# EAGLE board ABK-ECS - Rev B1 (EAGLE 7.7.0)
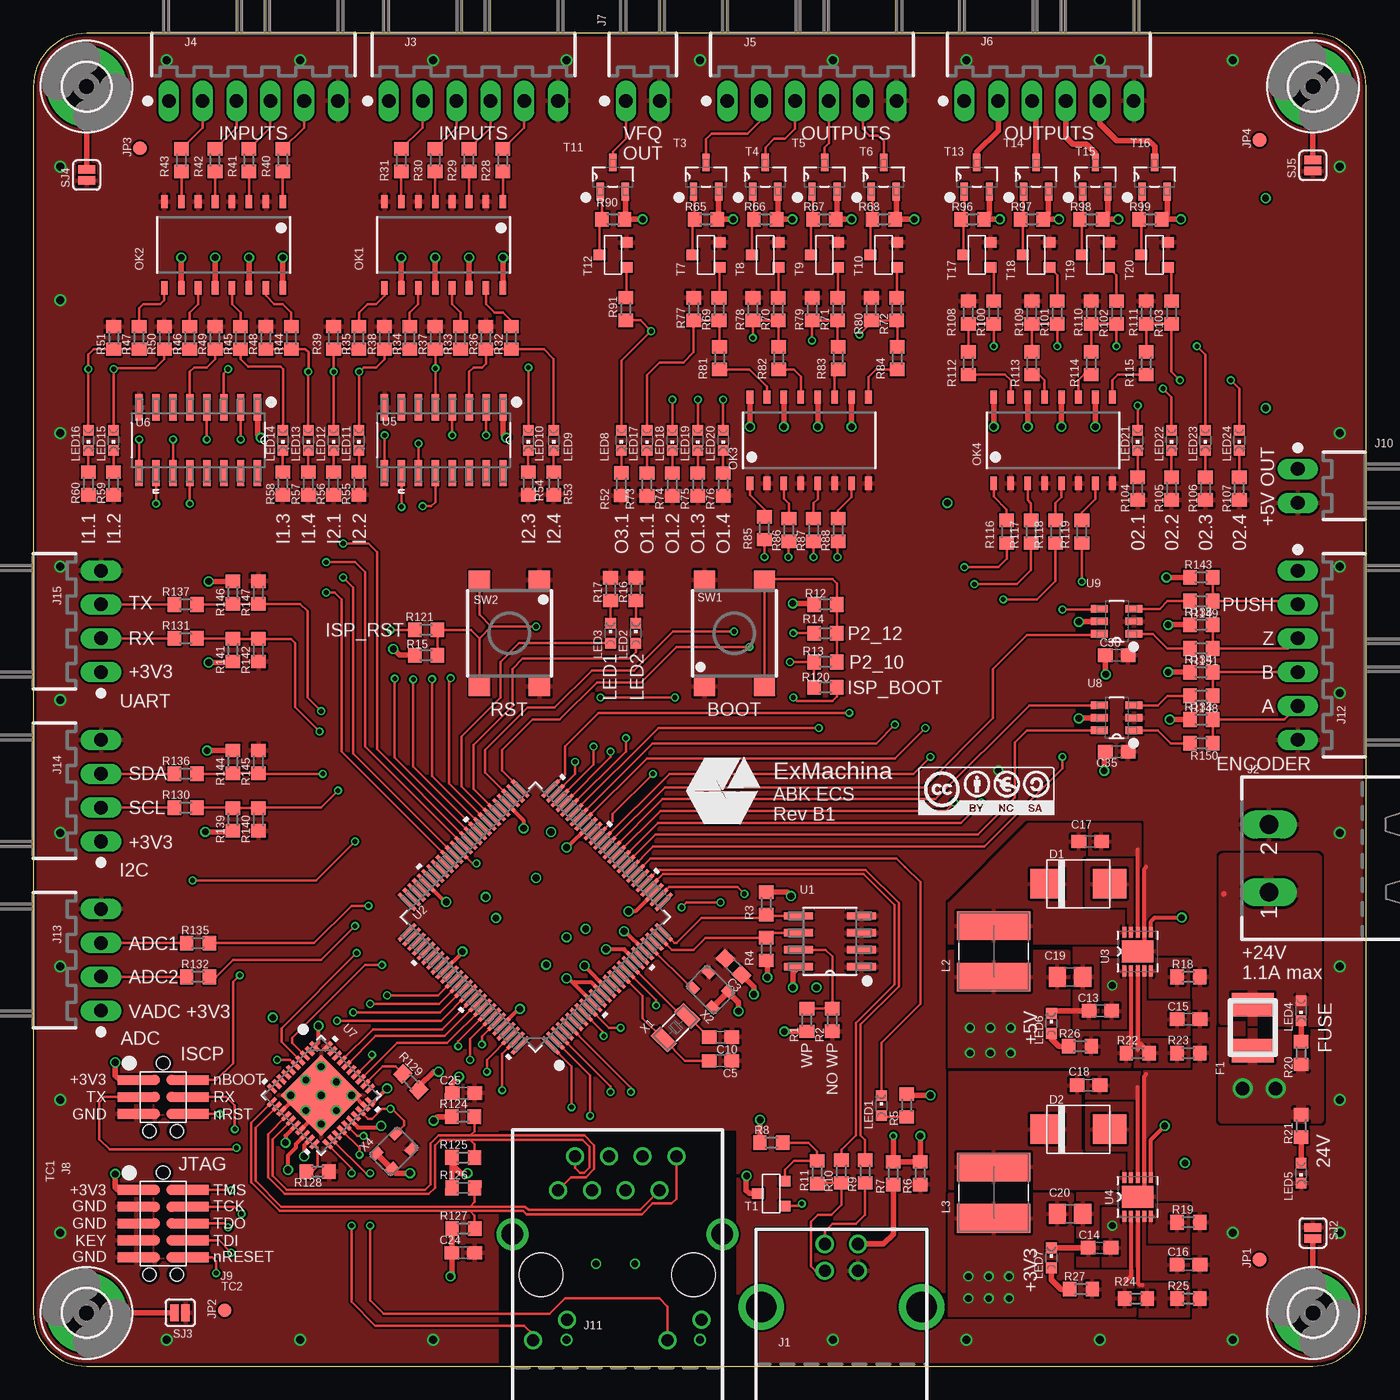
[diagram p8: board, top side]
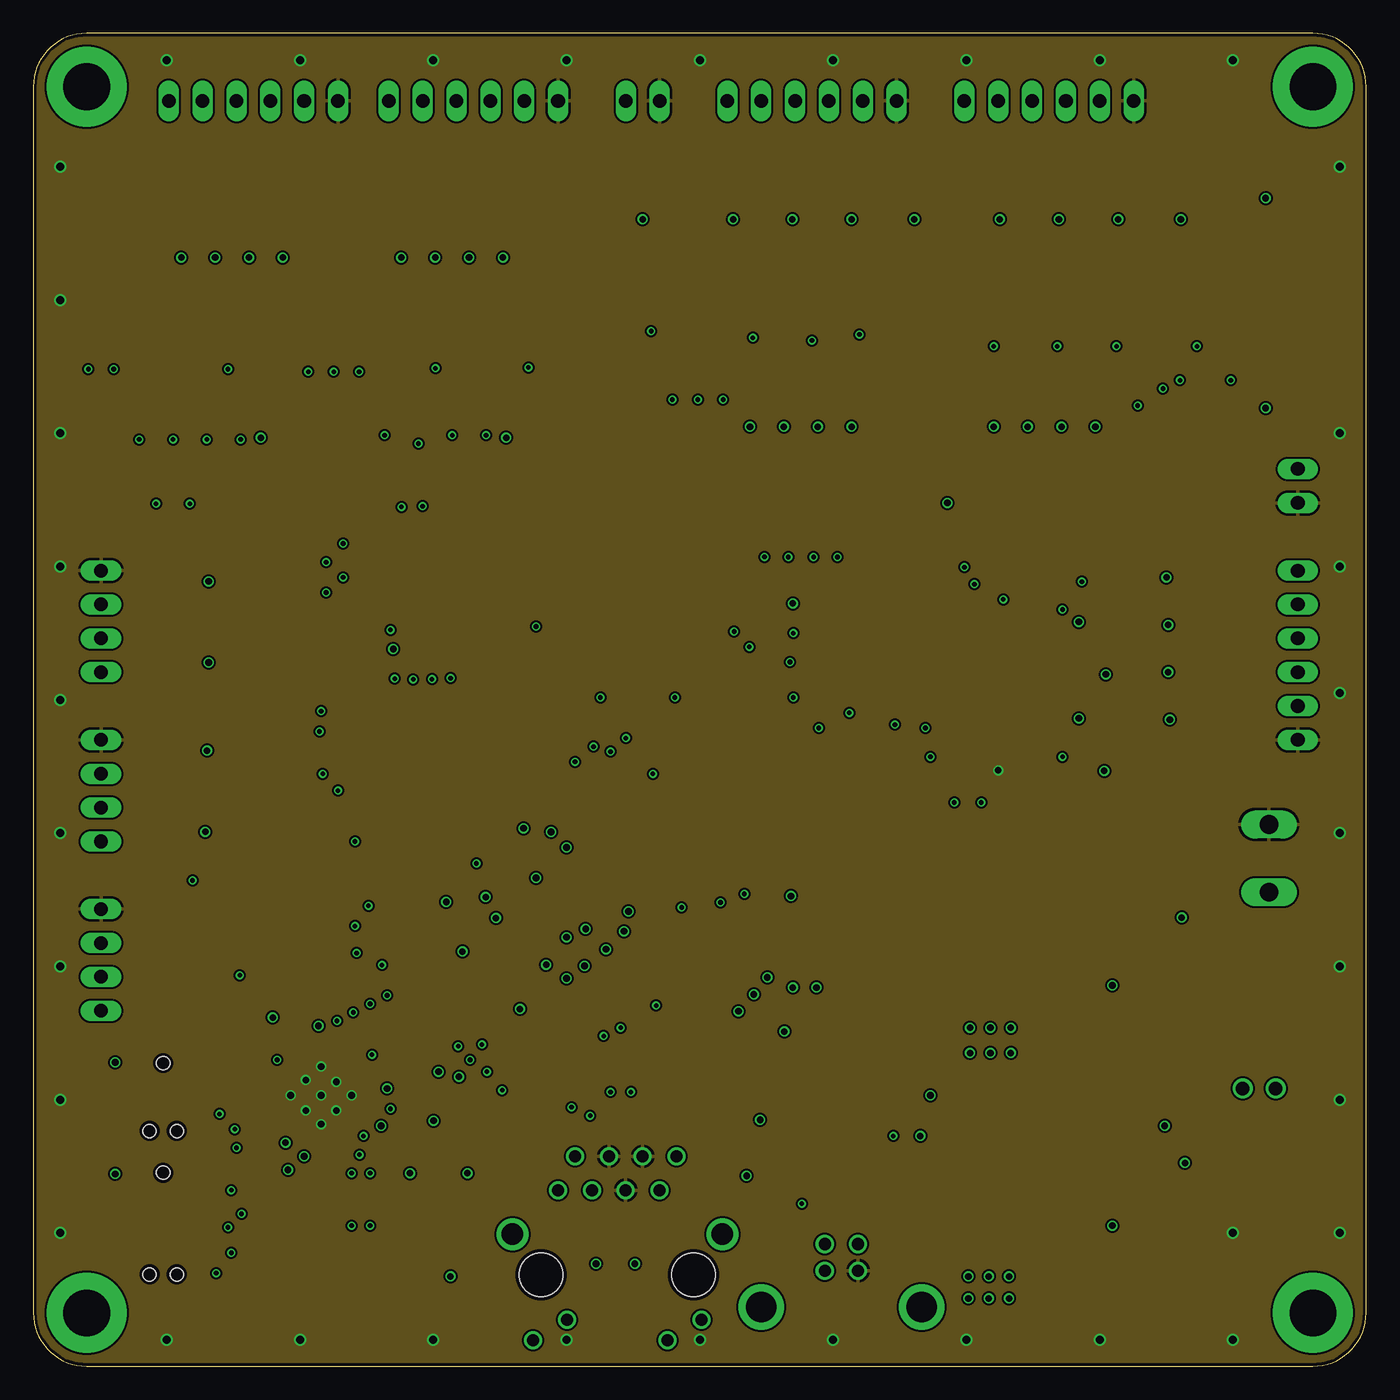
[diagram p9: board, inner layer Route2]
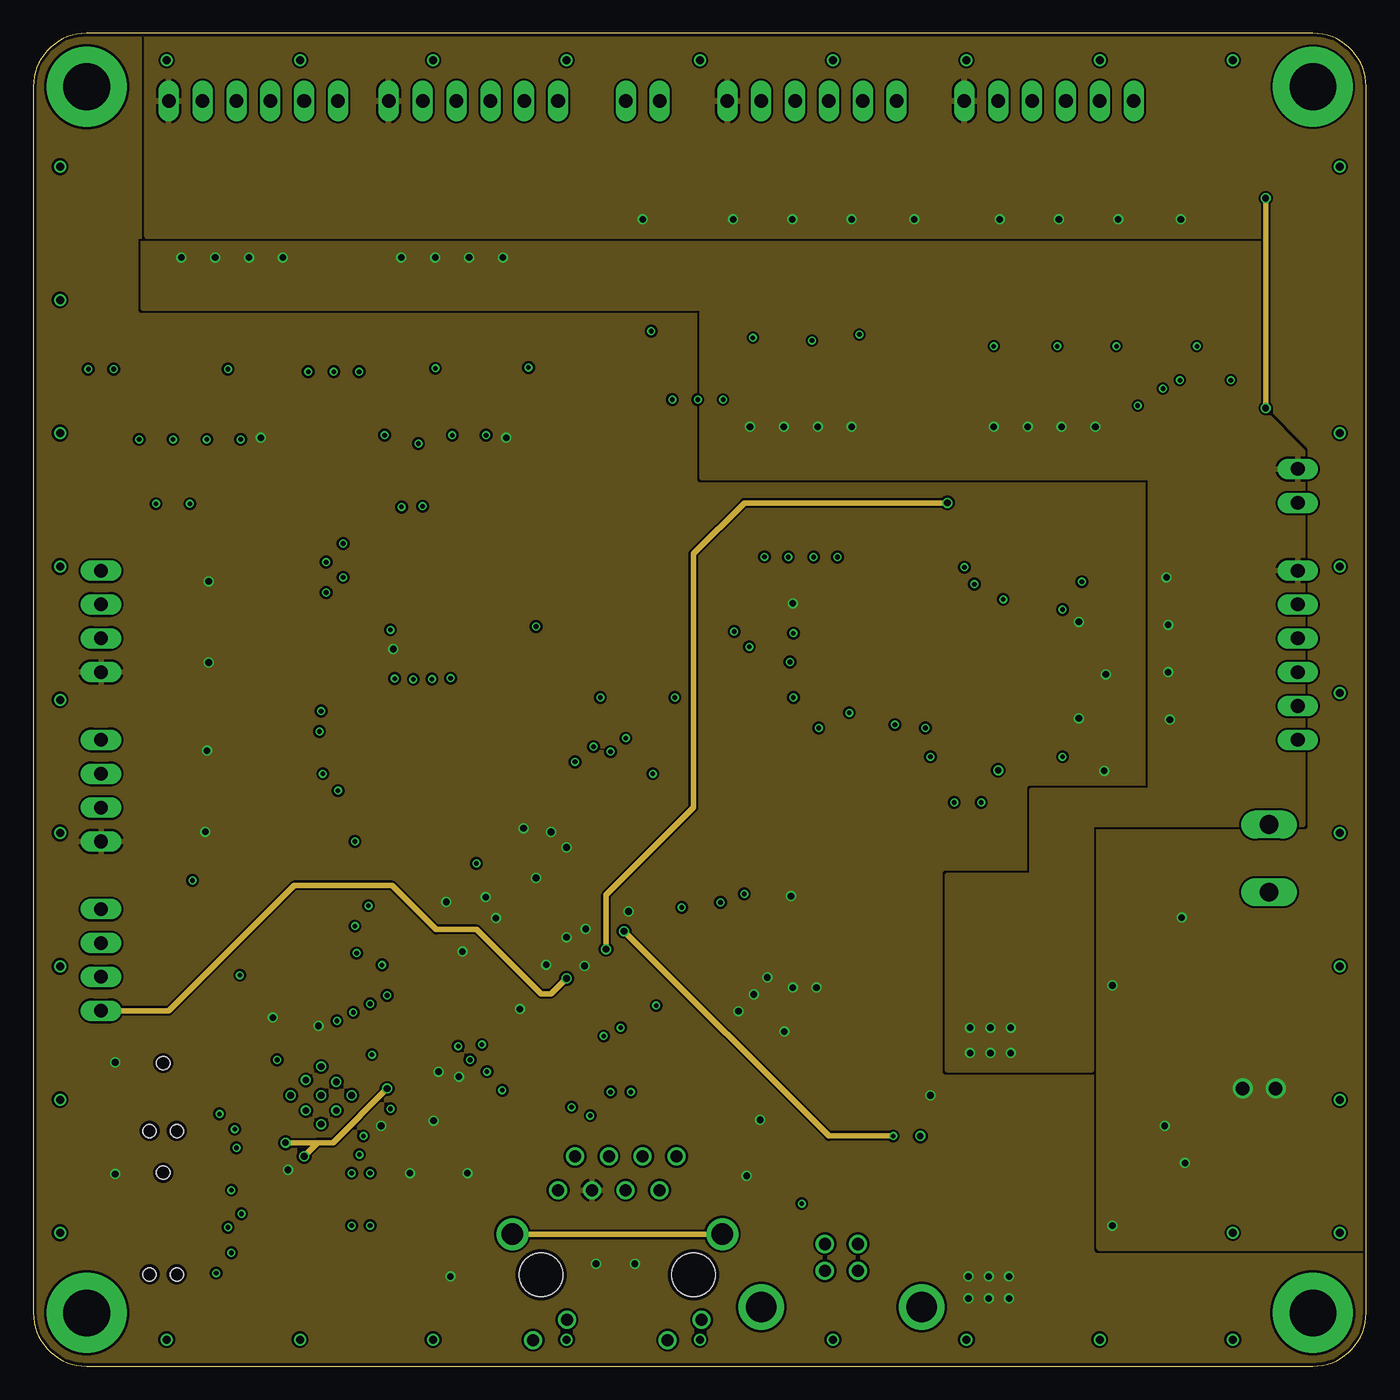
[diagram p10: board, inner layer Route15]
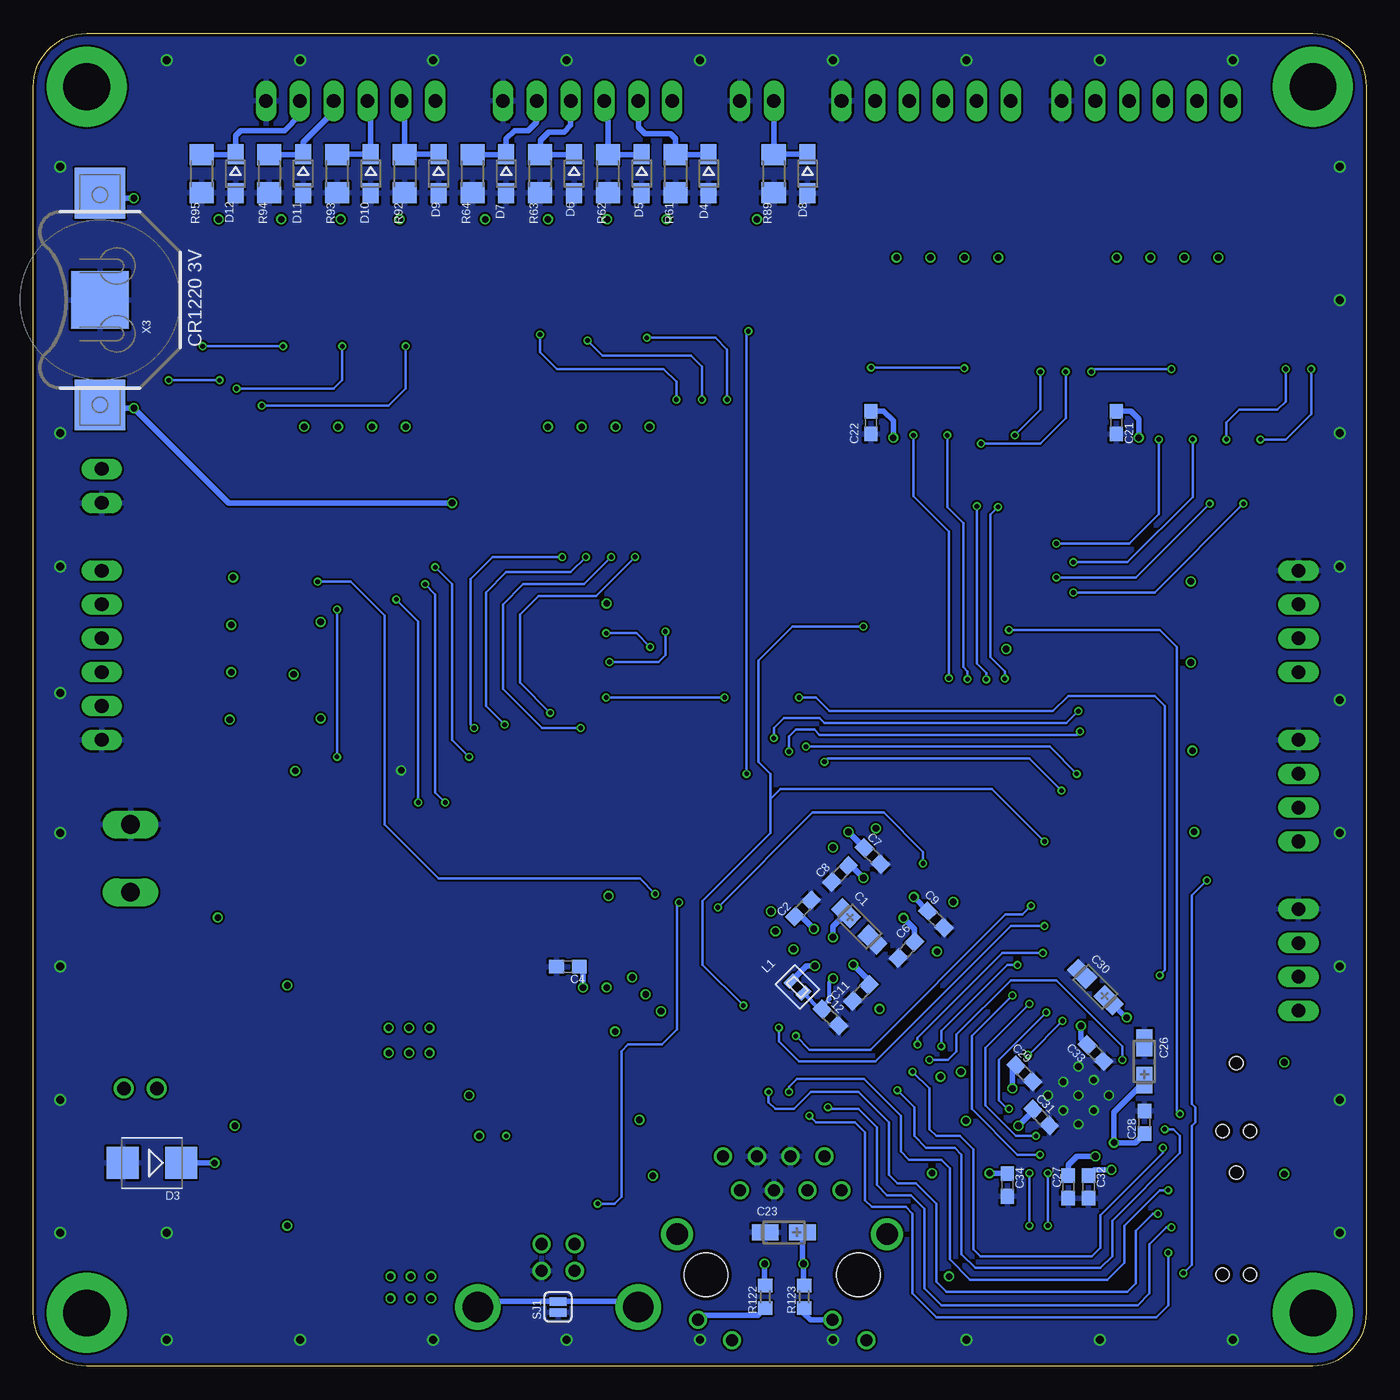
[diagram p11: board, bottom side, seen from below]

Size 100 x 100 mm. Coordinates in mm from the lower left corner, seen from the top.
Outline: 4,0 96,0 arc90 100,4 100,96 arc90 96,100 4,100 arc90 0,96 0,4 arc90 4,0
Copper layers (1+2*15+16): Top 0.018mm / dielectric 0.36mm / Route2 0.035mm / dielectric 0.71mm / Route15 0.035mm / dielectric 0.2mm / Bottom 0.018mm
Design rules "eC_4Layer_PClass6_BaseCopperO18-I35_eCDefault *": minimum track width 0.15mm, minimum drill 0.35mm, track to track 0.15mm, track to pad 0.15mm, pad to pad 0.15mm, via to via 0.15mm, smd to smd 0mil, copper to edge 0.25mm, drill to drill 0.35mm, minimum pad ring 0.175mm, minimum via ring 0.125mm, stop-mask expansion 0mil, vias tented up to drill 0.45mm, thermal gap 0.2mm
Net classes: 1 signal: width 0.178 mm, drill 0.35 mm; 2 supply: width 0.008 mm, drill 0.5 mm

## Footprints (pad centres in the part's own frame; a part is rotated, then mirrored left to right if it is on the bottom)
CT3216 = smd 2 x 1.2: + -1.4,0; - 1.4,0
C0603 = smd 1.1 x 1: 1 -0.85,0; 2 0.85,0
C0805 = smd 1.3 x 1.5: 1 -0.95,0; 2 0.95,0
DO-214AA = smd 2.5 x 2.2: A 2.35,0; C -2.35,0
SMB = smd 2.4 x 2.4: A 2.2,0; C -2.2,0
SOD323-W = smd 1.5 x 1.2: A 1.45,0; C -1.45,0
LITTLEFUSE_SMD = smd 1.78 x 3.15: 1 -1.725,0; 2 1.725,0
USB-B-S-RA = drill 0.914: 1 1.245,4.724; 2 -1.245,4.724; 3 -1.245,2.718; 4 1.245,2.718 | drill 2.286: SHL 6.02,0; SHL1 -6.02,0
MSTBA2 = drill 1.397 long: 1 -2.54,5.08; 2 2.54,5.08
7395-06 = drill 1.016 long: 1 6.35,0; 2 3.81,0; 3 1.27,0; 4 -1.27,0; 5 -3.81,0; 6 -6.35,0
7395-02 = drill 1.016 long: 1 1.27,0; 2 -1.27,0
FTSH-103-01-L-DV-NOPASTE = smd 0.737 x 2.794: 1 -1.27,-2.032; 2 -1.27,2.032; 3 0,-2.032; 4 0,2.032; 5 1.27,-2.032; 6 1.27,2.032
FTSH-105-01-L-DV-NOPASTE = smd 0.737 x 2.794: 1 -2.54,-2.032; 2 -2.54,2.032; 3 -1.27,-2.032; 4 -1.27,2.032; 5 0,-2.032; 6 0,2.032; 7 1.27,-2.032; 8 1.27,2.032; 9 2.54,-2.032; 10 2.54,2.032
WIZNET_RB1-125BAG1A = drill 0.9: L1 6.325,-3.38; L2 3.784,-4.899; L3 -3.786,-3.379; L4 -6.325,-4.9 | drill 0.9 pad 1.3: R1 -4.446,6.349; R2 -3.176,8.889; R3 -1.906,6.349; R4 -0.636,8.889; R5 0.634,6.349; R6 1.904,8.889; R7 3.174,6.349; R8 4.444,8.889 | drill 1.6 pad 2.184: S1 -7.876,3.049; S2 7.874,3.049 | hole 3.3: 5.714,-0.001; -5.716,-0.001
7395-04 = drill 1.016 long: 1 3.81,0; 2 1.27,0; 3 -1.27,0; 4 -3.81,0
FIDUCIAL-1X2 = smd 1 x 1: 1 0,0
0603 = smd 0.64 x 1.02: P$1 -0.64,0; P$2 0.64,0
WE-PD2_5848/5820 = smd 2.15 x 5.5: 1 -1.925,0; 2 1.925,0
CHIPLED_0603 = smd 0.8 x 0.8: A 0,-0.75; C 0,0.75
P3,5 = drill 3.5 pad 6: 1 0,0
MINI-FLAT-16 = smd 1 x 0.5: 1 -3.24,4.445; 2 -3.24,3.175; 3 -3.24,1.905; 4 -3.24,0.635; 5 -3.24,-0.635; 6 -3.24,-1.905; 7 -3.24,-3.175; 8 -3.24,-4.445; 9 3.24,-4.445; 10 3.24,-3.175; 11 3.24,-1.905; 12 3.24,-0.635; 13 3.24,0.635; 14 3.24,1.905; 15 3.24,3.175; 16 3.24,4.445
R0603 = smd 1 x 1.1: 1 -0.85,0; 2 0.85,0
R1206 = smd 1.6 x 1.803: 1 -1.422,0; 2 1.422,0
SJ_2S = smd 0.635 x 1.27: 1 -0.412,0; 2 0.412,0
B3FS = smd 1.4 x 1.6: 1 4,-2.25; 2 -4,-2.25; 3 4,2.25; 4 -4,2.25
SOT−23 = smd 0.787 x 0.889: 1 0.94,1.003; 2 -0.94,1.003; 3 0,-1.003
SOT95P240X112-3N = smd 1.321 x 0.559: 1 -1.092,0.94; 2 -1.092,-0.94; 3 1.092,0
TC2030-IDC-NL = smd 0.787 x 0.787: 1 -1.27,-0.635; 2 -1.27,0.635; 3 0,-0.635; 4 0,0.635; 5 1.27,-0.635; 6 1.27,0.635 | hole 0.991: -2.54,0; 2.54,1.016; 2.54,-1.016
TC2050-IDC-NL = smd 0.787 x 0.787: 1 -2.54,-0.635; 2 -2.54,0.635; 3 -1.27,-0.635; 4 -1.27,0.635; 5 0,-0.635; 6 0,0.635; 7 1.27,-0.635; 8 1.27,0.635; 9 2.54,-0.635; 10 2.54,0.635 | hole 0.991: -3.81,0; 3.81,1.016; 3.81,-1.016
SOIC127P600X175-8N = smd 2.184 x 0.559: 1 -2.362,1.905; 2 -2.362,0.635; 3 -2.362,-0.635; 4 -2.362,-1.905; 5 2.362,-1.905; 6 2.362,-0.635; 7 2.362,0.635; 8 2.362,1.905
SOT407-1 = smd 1.727 x 0.279: 1 -7.62,6; 2 -7.62,5.5; 3 -7.62,5; 4 -7.62,4.5; 5 -7.62,4; 6 -7.62,3.5; 7 -7.62,3; 8 -7.62,2.5; 9 -7.62,2; 10 -7.62,1.5; 11 -7.62,1; 12 -7.62,0.5; 13 -7.62,0; 14 -7.62,-0.5; 15 -7.62,-1; 16 -7.62,-1.5; 17 -7.62,-2; 18 -7.62,-2.5; 19 -7.62,-3; 20 -7.62,-3.5; 21 -7.62,-4; 22 -7.62,-4.5; 23 -7.62,-5; 24 -7.62,-5.5; 25 -7.62,-6; 51 7.62,-6; 52 7.62,-5.5; 53 7.62,-5; 54 7.62,-4.5; 55 7.62,-4; 56 7.62,-3.5; 57 7.62,-3; 58 7.62,-2.5; 59 7.62,-2; 60 7.62,-1.5; 61 7.62,-1; 62 7.62,-0.5; 63 7.62,0; 64 7.62,0.5; 65 7.62,1; 66 7.62,1.5; 67 7.62,2; 68 7.62,2.5; 69 7.62,3; 70 7.62,3.5; 71 7.62,4; 72 7.62,4.5; 73 7.62,5; 74 7.62,5.5; 75 7.62,6 | smd 0.279 x 1.727: 26 -6,-7.62; 27 -5.5,-7.62; 28 -5,-7.62; 29 -4.5,-7.62; 30 -4,-7.62; 31 -3.5,-7.62; 32 -3,-7.62; 33 -2.5,-7.62; 34 -2,-7.62; 35 -1.5,-7.62; 36 -1,-7.62; 37 -0.5,-7.62; 38 0,-7.62; 39 0.5,-7.62; 40 1,-7.62; 41 1.5,-7.62; 42 2,-7.62; 43 2.5,-7.62; 44 3,-7.62; 45 3.5,-7.62; 46 4,-7.62; 47 4.5,-7.62; 48 5,-7.62; 49 5.5,-7.62; 50 6,-7.62; 76 6,7.62; 77 5.5,7.62; 78 5,7.62; 79 4.5,7.62; 80 4,7.62; 81 3.5,7.62; 82 3,7.62; 83 2.5,7.62; 84 2,7.62; 85 1.5,7.62; 86 1,7.62; 87 0.5,7.62; 88 0,7.62; 89 -0.5,7.62; 90 -1,7.62; 91 -1.5,7.62; 92 -2,7.62; 93 -2.5,7.62; 94 -3,7.62; 95 -3.5,7.62; 96 -4,7.62; 97 -4.5,7.62; 98 -5,7.62; 99 -5.5,7.62; 100 -6,7.62
DFN300X300X80-11N = smd 0.813 x 0.305: 1 -1.448,0.991; 2 -1.448,0.508; 3 -1.448,0; 4 -1.448,-0.508; 5 -1.448,-0.991; 6 1.448,-0.991; 7 1.448,-0.508; 8 1.448,0; 9 1.448,0.508; 10 1.448,0.991 | smd 1.651 x 2.388: 11 0,0
SOIC127P600X175-16N = smd 1.981 x 0.559: 1 -2.464,4.445; 2 -2.464,3.175; 3 -2.464,1.905; 4 -2.464,0.635; 5 -2.464,-0.635; 6 -2.464,-1.905; 7 -2.464,-3.175; 8 -2.464,-4.445; 9 2.464,-4.445; 10 2.464,-3.175; 11 2.464,-1.905; 12 2.464,-0.635; 13 2.464,0.635; 14 2.464,1.905; 15 2.464,3.175; 16 2.464,4.445
SQA40B = smd 0.813 x 0.305: 1 -2.946,2.25; 2 -2.946,1.75; 3 -2.946,1.25; 4 -2.946,0.75; 5 -2.946,0.25; 6 -2.946,-0.25; 7 -2.946,-0.75; 8 -2.946,-1.25; 9 -2.946,-1.75; 10 -2.946,-2.25; 21 2.946,-2.25; 22 2.946,-1.75; 23 2.946,-1.25; 24 2.946,-0.75; 25 2.946,-0.25; 26 2.946,0.25; 27 2.946,0.75; 28 2.946,1.25; 29 2.946,1.75; 30 2.946,2.25 | smd 0.305 x 0.813: 11 -2.25,-2.946; 12 -1.75,-2.946; 13 -1.25,-2.946; 14 -0.75,-2.946; 15 -0.25,-2.946; 16 0.25,-2.946; 17 0.75,-2.946; 18 1.25,-2.946; 19 1.75,-2.946; 20 2.25,-2.946; 31 2.25,2.946; 32 1.75,2.946; 33 1.25,2.946; 34 0.75,2.946; 35 0.25,2.946; 36 -0.25,2.946; 37 -0.75,2.946; 38 -1.25,2.946; 39 -1.75,2.946; 40 -2.25,2.946 | smd 4.3 x 4.3: 41 0,0
SOT95P280X145-6N = smd 1.27 x 0.559: 1 -1.295,0.94; 2 -1.295,0; 3 -1.295,-0.94; 4 1.295,-0.94; 5 1.295,0; 6 1.295,0.94
FC-135 = smd 1 x 1.8: 1 -1.25,0; 2 1.25,0
ASE = smd 0.9 x 0.65: 1 -1.05,-0.825; 2 1.05,-0.825; 3 1.05,0.825; 4 -1.05,0.825
3000 = smd 3.81 x 3.81: +1 -7.874,0; +2 8.001,0 | smd 4.318 x 4.318: - 0,0

## Placement (x,y rotation side)
C1  10uF  [CT3216]  38.03,32.99 315 bottom
C2  0.1uF  [C0603]  42.25,34.34 45 bottom
C3  0.1uF  [C0603]  52.53,29.97 135 top
C4  0.1uF  [C0603]  59.89,29.97 180 bottom
C5  18pF  [C0603]  51.56,22.91 0 top
C6  0.1uF  [C0603]  34.49,31.24 225 bottom
C7  0.1uF  [C0603]  37.05,38.29 315 bottom
C8  0.1uF  [C0603]  39.47,36.94 225 bottom
C9  0.1uF  [C0603]  32.29,33.53 315 bottom
C10  18pF  [C0603]  51.56,24.69 0 top
C11  0.1uF  [C0603]  37.9,28.01 225 bottom
C12  0.1uF  [C0603]  40.2,26.18 315 bottom
C13  2.2uF  [C0603]  80.06,26.67 180 top
C14  2.2uF  [C0603]  80,8.89 180 top
C15  1000pF  [C0603]  86.67,26.04 0 top
C16  1000pF  [C0603]  86.67,7.62 0 top
C17  2.2uF  [C0603]  79.3,39.37 180 top
C18  2.2uF  [C0603]  79.17,21.08 180 top
C19  22uF  [C0805]  77.78,29.21 0 top
C20  22uF  [C0805]  77.78,11.43 0 top
C21  0.1uF  [C0603]  18.75,70.8 270 bottom
C22  0.1uF  [C0603]  37.16,70.8 270 bottom
C23  4.7uF  [CT3216]  43.69,10.03 180 bottom
C24  100nF  [C0603]  32.26,8.51 359.8 top
C25  100nF  [C0603]  32.27,20.49 359.8 top
C26  10uF  [CT3216]  16.64,22.86 90 bottom
C27  100nF  [C0603]  22.35,13.46 270 bottom
C28  100nF  [C0603]  16.64,18.29 90 bottom
C29  100nF  [C0603]  25.65,21.97 315 bottom
C30  10uF  [CT3216]  20.32,28.45 135 bottom
C31  100nF  [C0603]  24.38,18.67 315 bottom
C32  100nF  [C0603]  20.83,13.46 270 bottom
C33  100nF  [C0603]  20.32,23.5 315 bottom
C34  100nF  [C0603]  26.92,13.59 270 bottom
C35  0.1uF  [C0603]  81.28,46.1 0 top
C36  0.1uF  [C0603]  81.28,53.34 0 top
CC1  CC-BY-NC-SA  [CC-BY-NC-SA]  71.5,43.13 0 top
D1  MBRS140  [DO-214AA]  78.41,36.2 0 top
D2  MBRS140  [DO-214AA]  78.41,17.78 0 top
D3  STPS3L40UF  [SMB]  91.11,15.24 180 bottom
D4  1N4148WS  [SOD323-W]  49.33,89.47 270 bottom
D5  1N4148WS  [SOD323-W]  54.36,89.47 270 bottom
D6  1N4148WS  [SOD323-W]  59.44,89.47 270 bottom
D7  1N4148WS  [SOD323-W]  64.52,89.47 270 bottom
D8  1N4148WS  [SOD323-W]  41.91,89.47 270 bottom
D9  1N4148WS  [SOD323-W]  69.6,89.47 270 bottom
D10  1N4148WS  [SOD323-W]  74.68,89.47 270 bottom
D11  1N4148WS  [SOD323-W]  79.76,89.47 270 bottom
D12  1N4148WS  [SOD323-W]  84.84,89.47 270 bottom
F1  1812L110/24DR  [LITTLEFUSE_SMD]  91.49,25.4 270 top
J1  USB-B-S-RA  [USB-B-S-RA]  60.63,4.45 0 top
J2  MSTBA2  [MSTBA2]  97.79,38.1 90 top
J3  22-05-7068-06  [7395-06]  33.02,94.93 180 top
J4  22-05-7068-06  [7395-06]  16.51,94.93 180 top
J5  22-05-7068-06  [7395-06]  58.42,94.93 180 top
J6  22-05-7068-06  [7395-06]  76.2,94.93 180 top
J7  22-05-7028-02  [7395-02]  45.72,94.93 180 top
J8  FTSH-103-01-L-DV-NOPASTE  [FTSH-103-01-L-DV-NOPASTE]  9.74,20.19 270 top
J9  FTSH-105-01-L-DV-NOPASTE  [FTSH-105-01-L-DV-NOPASTE]  9.74,10.7 270 top
J10  22-05-7028-02  [7395-02]  94.87,66.04 90 top
J11  RB1-125BAG1A  [WIZNET_RB1-125BAG1A]  43.81,6.86 0 top
J12  22-05-7068-06  [7395-06]  94.87,53.34 90 top
J13  22-05-7048-04  [7395-04]  5.08,30.48 270 top
J14  22-05-7048-04  [7395-04]  5.08,43.18 270 top
J15  22-05-7048-04  [7395-04]  5.08,55.88 270 top
JP1  FIDUCIAL1X2  [FIDUCIAL-1X2]  92,8 90 top
JP2  FIDUCIAL1X2  [FIDUCIAL-1X2]  14.35,4.19 90 top
JP3  FIDUCIAL1X2  [FIDUCIAL-1X2]  8,91.36 90 top
JP4  FIDUCIAL1X2  [FIDUCIAL-1X2]  92,92 90 top
L1  0603PS-103KLB  [0603]  42.67,28.45 315 bottom
L2  15uH  [WE-PD2_5848/5820]  72.06,31.11 270 top
L3  10uH  [WE-PD2_5848/5820]  72.06,13.02 270 top
LED1  Blue  [CHIPLED_0603]  63.63,19.56 0 top
LED2  Blue  [CHIPLED_0603]  45.21,54.99 0 top
LED3  Blue  [CHIPLED_0603]  43.31,54.99 0 top
LED4  Red  [CHIPLED_0603]  95.12,26.67 180 top
LED5  Blue  [CHIPLED_0603]  95.12,14.48 180 top
LED6  Blue  [CHIPLED_0603]  76.38,25.72 0 top
LED7  Blue  [CHIPLED_0603]  76.38,8.13 0 top
LED8  Blue  [CHIPLED_0603]  44.12,69.47 180 top
LED9  Blue  [CHIPLED_0603]  39.04,69.47 180 top
LED10  Blue  [CHIPLED_0603]  37.13,69.47 180 top
LED11  Blue  [CHIPLED_0603]  24.43,69.47 180 top
LED12  Blue  [CHIPLED_0603]  22.53,69.47 180 top
LED13  Blue  [CHIPLED_0603]  20.62,69.47 180 top
LED14  Blue  [CHIPLED_0603]  18.72,69.47 180 top
LED15  Blue  [CHIPLED_0603]  6.02,69.47 180 top
LED16  Blue  [CHIPLED_0603]  4.13,69.47 180 top
LED17  Blue  [CHIPLED_0603]  46.04,69.46 180 top
LED18  Blue  [CHIPLED_0603]  47.95,69.46 180 top
LED19  Blue  [CHIPLED_0603]  49.85,69.46 180 top
LED20  Blue  [CHIPLED_0603]  51.76,69.46 180 top
LED21  Blue  [CHIPLED_0603]  82.86,69.47 180 top
LED22  Blue  [CHIPLED_0603]  85.39,69.47 180 top
LED23  Blue  [CHIPLED_0603]  87.94,69.47 180 top
LED24  Blue  [CHIPLED_0603]  90.47,69.47 180 top
MP1  MOUNT-PAD3.5  [P3,5]  96,4 90 top
MP2  MOUNT-PAD3.5  [P3,5]  4,4 90 top
MP3  MOUNT-PAD3.5  [P3,5]  4,96 90 top
MP4  MOUNT-PAD3.5  [P3,5]  96,96 90 top
OK1  TLP283-4  [MINI-FLAT-16]  30.79,84.14 270 top
OK2  TLP283-4  [MINI-FLAT-16]  14.28,84.14 270 top
OK3  TLP283-4  [MINI-FLAT-16]  58.22,69.47 90 top
OK4  TLP283-4  [MINI-FLAT-16]  76.5,69.47 90 top
R1  4K7, DNI  [R0603]  58.04,25.97 90 top
R2  4K7  [R0603]  59.94,25.98 270 top
R3  4K7  [R0603]  54.99,34.72 90 top
R4  4K7  [R0603]  54.99,31.29 270 top
R5  1K5  [R0603]  65.53,19.56 270 top
R6  39K  [R0603]  66.55,14.48 90 top
R7  24K  [R0603]  64.52,14.48 270 top
R8  0R, DNI  [R0603]  55.37,16.76 0 top
R9  33  [R0603]  62.41,14.61 90 top
R10  33  [R0603]  60.63,14.61 90 top
R11  1K5  [R0603]  58.8,14.55 270 top
R12  10K  [R0603]  59.44,57.15 180 top
R13  0R  [R0603]  59.44,52.83 0 top
R14  0R  [R0603]  59.44,54.99 0 top
R15  10K  [R0603]  29.46,53.34 180 top
R16  1K5  [R0603]  45.21,58.29 90 top
R17  1K5  [R0603]  43.31,58.29 90 top
R18  31K6  [R0603]  86.67,29.21 180 top
R19  31K6  [R0603]  86.67,10.79 180 top
R20  4K7  [R0603]  95.12,23.5 270 top
R21  4K7  [R0603]  95.12,18.03 90 top
R22  52K3  [R0603]  82.86,23.5 180 top
R23  10K  [R0603]  86.67,23.5 180 top
R24  31K6  [R0603]  82.73,5.08 180 top
R25  10K  [R0603]  86.67,5.08 180 top
R26  1K5  [R0603]  78.54,24 0 top
R27  1K5  [R0603]  78.6,5.78 0 top
R28  1K  [R0603]  35.23,90.48 270 top
R29  1K  [R0603]  32.69,90.48 270 top
R30  1K  [R0603]  30.15,90.48 270 top
R31  1K  [R0603]  27.61,90.48 270 top
R32  1K  [R0603]  35.87,77.15 270 top
R33  1K  [R0603]  32.05,77.15 270 top
R34  1K  [R0603]  28.25,77.15 270 top
R35  1K  [R0603]  24.43,77.15 270 top
R36  4K7  [R0603]  33.96,77.15 90 top
R37  4K7  [R0603]  30.15,77.15 90 top
R38  4K7  [R0603]  26.34,77.15 90 top
R39  4K7  [R0603]  22.53,77.15 90 top
R40  1K  [R0603]  18.72,90.48 270 top
R41  1K  [R0603]  16.18,90.48 270 top
R42  1K  [R0603]  13.64,90.48 270 top
R43  1K  [R0603]  11.11,90.48 270 top
R44  1K  [R0603]  19.36,77.15 270 top
R45  1K  [R0603]  15.54,77.15 270 top
R46  1K  [R0603]  11.73,77.15 270 top
R47  1K  [R0603]  7.94,77.15 270 top
R48  4K7  [R0603]  17.45,77.15 90 top
R49  4K7  [R0603]  13.64,77.15 90 top
R50  4K7  [R0603]  9.83,77.15 90 top
R51  4K7  [R0603]  6.03,77.15 90 top
R52  1K5  [R0603]  44.12,66.17 270 top
R53  1K5  [R0603]  39.04,66.23 270 top
R54  1K5  [R0603]  37.13,66.23 270 top
R55  1K5  [R0603]  24.43,66.23 270 top
R56  1K5  [R0603]  22.53,66.23 270 top
R57  1K5  [R0603]  20.62,66.23 270 top
R58  1K5  [R0603]  18.72,66.23 270 top
R59  1K5  [R0603]  6.02,66.23 270 top
R60  1K5  [R0603]  4.13,66.23 270 top
R61  1K  [R1206]  51.82,89.47 90 bottom
R62  1K  [R1206]  56.9,89.47 90 bottom
R63  1K  [R1206]  61.98,89.47 90 bottom
R64  1K  [R1206]  67.06,89.47 90 bottom
R65  10K  [R0603]  50.47,86.04 0 top
R66  10K  [R0603]  54.91,86.04 0 top
R67  10K  [R0603]  59.36,86.04 0 top
R68  10K  [R0603]  63.8,86.04 0 top
R69  1K  [R0603]  51.45,79.31 90 top
R70  1K  [R0603]  55.89,79.31 90 top
R71  1K  [R0603]  60.34,79.31 90 top
R72  1K  [R0603]  64.78,79.31 90 top
R73  1K5  [R0603]  46.04,66.15 270 top
R74  1K5  [R0603]  47.95,66.15 270 top
R75  1K5  [R0603]  49.85,66.15 270 top
R76  1K5  [R0603]  51.76,66.15 270 top
R77  4K7  [R0603]  49.54,79.31 90 top
R78  4K7  [R0603]  53.99,79.31 90 top
R79  4K7  [R0603]  58.43,79.31 90 top
R80  4K7  [R0603]  62.88,79.31 90 top
R81  100  [R0603]  51.49,75.63 270 top
R82  100  [R0603]  55.93,75.63 270 top
R83  100  [R0603]  60.38,75.63 270 top
R84  100  [R0603]  64.82,75.63 270 top
R85  330  [R0603]  54.85,62.87 270 top
R86  330  [R0603]  56.69,62.74 270 top
R87  330  [R0603]  58.53,62.74 270 top
R88  330  [R0603]  60.38,62.74 270 top
R89  1K  [R1206]  44.45,89.47 90 bottom
R90  10K  [R0603]  43.51,86.04 0 top
R91  100  [R0603]  44.45,79.32 270 top
R92  1K  [R1206]  72.14,89.47 90 bottom
R93  1K  [R1206]  77.22,89.47 90 bottom
R94  1K  [R1206]  82.3,89.47 90 bottom
R95  1K  [R1206]  87.38,89.47 90 bottom
R96  10K  [R0603]  70.47,86.04 0 top
R97  10K  [R0603]  74.92,86.04 0 top
R98  10K  [R0603]  79.36,86.04 0 top
R99  10K  [R0603]  83.81,86.04 0 top
R100  1K  [R0603]  72.06,79.06 90 top
R101  1K  [R0603]  76.82,79.06 90 top
R102  1K  [R0603]  81.27,79.06 90 top
R103  1K  [R0603]  85.39,79.06 90 top
R104  1K5  [R0603]  82.86,65.85 270 top
R105  1K5  [R0603]  85.39,65.85 270 top
R106  1K5  [R0603]  87.94,65.85 270 top
R107  1K5  [R0603]  90.47,65.85 270 top
R108  4K7  [R0603]  70.16,79.06 90 top
R109  4K7  [R0603]  74.92,79.06 90 top
R110  4K7  [R0603]  79.36,79.06 90 top
R111  4K7  [R0603]  83.49,79.06 90 top
R112  100  [R0603]  70.16,75.25 270 top
R113  100  [R0603]  74.92,75.25 270 top
R114  100  [R0603]  79.36,75.25 270 top
R115  100  [R0603]  83.49,75.25 270 top
R116  330  [R0603]  73.01,62.61 270 top
R117  330  [R0603]  74.85,62.61 270 top
R118  330  [R0603]  76.7,62.61 270 top
R119  330  [R0603]  78.66,62.61 270 top
R120  0R  [R0603]  59.44,50.93 0 top
R121  0R  [R0603]  29.46,55.24 180 top
R122  220  [R0603]  45.09,5.21 90 bottom
R123  220  [R0603]  42.16,5.21 90 bottom
R124  49.9  [R0603]  32.24,18.71 359.8 top
R125  49.9  [R0603]  32.25,15.67 359.8 top
R126  49.9  [R0603]  32.26,13.38 359.8 top
R127  49.9  [R0603]  32.27,10.33 359.8 top
R128  4K7  [R0603]  21.34,14.61 0 top
R129  2K2  [R0603]  28.32,21.34 135 top
R130  1K  [R0603]  11.43,41.91 0 top
R131  1K  [R0603]  11.43,54.61 0 top
R132  1K  [R0603]  12.36,29.21 0 top
R133  4K7  [R0603]  87.63,48.51 0 top
R134  4K7  [R0603]  87.63,52.07 0 top
R135  1K  [R0603]  12.36,31.75 0 top
R136  1K  [R0603]  11.43,44.45 0 top
R137  1K  [R0603]  11.43,57.15 0 top
R138  4K7  [R0603]  87.63,55.63 0 top
R139  1K  [R0603]  14.99,41.02 90 top
R140  1K  [R0603]  16.89,41.02 90 top
R141  1K  [R0603]  14.99,53.72 90 top
R142  1K  [R0603]  16.89,53.72 90 top
R143  4K7  [R0603]  87.63,59.18 0 top
R144  1K  [R0603]  14.99,45.34 270 top
R145  1K  [R0603]  16.89,45.34 270 top
R146  1K  [R0603]  14.99,58.04 270 top
R147  1K  [R0603]  16.89,58.04 270 top
R148  1K  [R0603]  87.63,50.29 180 top
R149  1K  [R0603]  87.63,57.4 180 top
R150  1K  [R0603]  87.63,46.74 180 top
R151  1K  [R0603]  87.63,53.85 180 top
SJ1  SJNC  [SJ_2S]  60.63,4.45 90 bottom
SJ2  SJNC  [SJ_2S]  96,10 270 top
SJ3  SJNC  [SJ_2S]  11.02,4 180 top
SJ4  SJNC  [SJ_2S]  4,89.36 90 top
SJ5  SJNC  [SJ_2S]  96,90.08 90 top
SW1  B3FS-1015  [B3FS]  52.6,54.99 270 top
SW2  B3FS-1015  [B3FS]  35.72,54.99 90 top
T1  MMBT2907ALT3  [SOT−23]  55.37,12.95 270 top
T2  EXMACHINA-LOGO-NAME  [EXM-LOGO-BASELINE]  51.69,43.13 0 top
T3  IRLML5103TRPBF  [SOT95P240X112-3N]  50.47,89.22 90 top
T4  IRLML5103TRPBF  [SOT95P240X112-3N]  54.91,89.22 90 top
T5  IRLML5103TRPBF  [SOT95P240X112-3N]  59.36,89.22 90 top
T6  IRLML5103TRPBF  [SOT95P240X112-3N]  63.8,89.22 90 top
T7  MMBT2222AL  [SOT−23]  50.47,83.37 270 top
T8  MMBT2222AL  [SOT−23]  54.91,83.37 270 top
T9  MMBT2222AL  [SOT−23]  59.36,83.37 270 top
T10  MMBT2222AL  [SOT−23]  63.8,83.37 270 top
T11  IRLML5103TRPBF  [SOT95P240X112-3N]  43.48,89.22 90 top
T12  MMBT2222AL  [SOT−23]  43.5,83.36 270 top
T13  IRLML5103TRPBF  [SOT95P240X112-3N]  70.79,89.22 90 top
T14  IRLML5103TRPBF  [SOT95P240X112-3N]  75.23,89.22 90 top
T15  IRLML5103TRPBF  [SOT95P240X112-3N]  79.68,89.22 90 top
T16  IRLML5103TRPBF  [SOT95P240X112-3N]  84.12,89.22 90 top
T17  MMBT2222AL  [SOT−23]  70.79,83.37 270 top
T18  MMBT2222AL  [SOT−23]  75.23,83.37 270 top
T19  MMBT2222AL  [SOT−23]  79.68,83.37 270 top
T20  MMBT2222AL  [SOT−23]  84.12,83.37 270 top
TC1  TC2030-IDC-NL  [TC2030-IDC-NL]  9.74,20.19 270 top
TC2  TC2050-IDC-NL  [TC2050-IDC-NL]  9.74,10.7 270 top
U1  AT24C512C-SSHM-B  [SOIC127P600X175-8N]  59.77,31.88 180 top
U2  LPC1768FBD100  [SOT407-1]  37.67,33.7 135 top
U3  LT3686HDDPBF  [DFN300X300X80-11N]  82.86,31.11 90 top
U4  LT3686HDDPBF  [DFN300X300X80-11N]  82.86,12.7 90 top
U5  CD4050BD  [SOIC127P600X175-16N]  30.8,69.47 270 top
U6  CD4050BD  [SOIC127P600X175-16N]  12.38,69.47 270 top
U7  DP83848JSQ/NOPB  [SQA40B]  21.59,20.32 315 top
U8  SN74LVC2G17DBVR  [SOT95P280X145-6N]  81.28,48.64 180 top
U9  SN74LVC2G17DBVR  [SOT95P280X145-6N]  81.28,55.88 180 top
X1  FC-135  [FC-135]  48.18,25.4 45 top
X2  ASE-12  [ASE]  50.8,28.25 135 top
X3  3000  [3000]  95,80 90 bottom
X4  ASE_50  [ASE]  27.05,16.13 45 top

## Tracks (layer width: path | path; a pad name or v marks a point on that pad's centre or on a via)
1
  Top 0.406: MP1.1 SJ2.2
2
  Top 0.406: SJ3.2 MP2.1
3
  Top 0.406: SJ4.2 MP3.1
4
  Top 0.406: MP4.1 SJ5.2
!ISP_BOOT  (via drill 0.35)
  Top 0.178: TC1.2 J8.2 13.72,21.46 14.99,22.73 14.99,28.83 v15.49,29.34 | v42.55,50.16 v48.13,50.16 | v57.02,50.16 57.28,49.91 59.94,49.91 60.29,50.25 R120.2
  Bottom 0.178: v15.49,29.34 15.11,29.72 15.11,49.53 15.88,50.29 22.35,50.29 23.5,49.15 40.26,49.15 41.27,50.16 v42.55,50.16 | v48.13,50.16 v57.02,50.16
!ISP_RST  (via drill 0.35)
  Top 0.178: TC1.6 J8.6 v13.97,18.92 | v26.8,55.24 R121.2
  Bottom 0.178: v13.97,18.92 14.22,19.18 14.22,53.98 15.49,55.24 v26.8,55.24
!RESET  (via drill 0.35)
  Top 0.178: TC2.10 J9.10 13.43,8.16 13.72,7.87 v13.72,6.99 | U2.17 46.74,27.46 v46.74,27.05 | 33.47,54.61 SW2.4 | R15.1 R121.1 32.84,55.24 33.47,54.61 | 33.47,54.61 34.36,55.5 | 34.36,55.5 v37.72,55.5 | SW2.3 33.47,56.39 34.36,55.5 | v11.94,36.45 21.21,36.45 v24.13,39.37
  Bottom 0.178: v37.72,55.5 43.05,55.5 45.59,52.96 45.59,45.34 44.7,44.45 44.7,42.55 | v46.74,27.05 49.78,30.1 49.78,34.92 44.7,40.01 44.7,42.55 | v11.94,36.45 13.08,35.31 13.08,19.68 12.83,19.43 12.83,18.29 13.08,18.03 13.08,7.62 v13.72,6.99 | v24.13,39.37 28.07,43.31 43.94,43.31 44.7,42.55
+3V3  (via drill 0.5)
  Top 0.305: U4.2 82.35,6.73 82,6.39 | v36.51,26.8 36.42,26.8 U2.96 | U2.13 41.36,30.02 v41.36,30.03 | U2.28 45.16,34.12 v44.66,34.12 | U2.42 40.06,38.92 v40.01,38.92 | U2.54 36.78,40.96 v36.78,40.36 | U2.71 30.88,34.83 v30.98,34.83 | U2.84 32.2,31.05 v32.2,31.11 | U7.18 19.68,16.65 19.68,16.38 19.11,15.81 v19.11,14.73 | U7.1 21.39,24.29 v21.39,25.52 | U7.26 24.36,17.91 25.97,17.91 v26.09,18.03
  Top 0.406: U6.1 16.83,69.9 v17.07,69.66 | U5.1 35.24,69.9 v35.48,69.66 | C3.1 54.05,28.44 v54.05,27.9 | X2.4 X2.1 52.91,27.3 v52.91,26.63 | 55.04,35.52 R3.2 56.54,35.57 v56.85,35.27 | v56.98,28.41 56.98,29.54 U1.8 | TC2.1 J9.1 6.32,13.24 6.15,13.41 v6.15,14.41 | TC1.1 J8.1 6.48,21.46 6.15,21.79 v6.15,22.8 | R126.1 31.41,15.11 | 31.41,15.11 31.41,15.66 R125.1 | 31.39,20.46 C25.1 31.42,21.2 v31.93,21.71 | R127.1 31.42,8.52 C24.1 31.41,6.84 v31.3,6.73 | R129.1 28.92,20.99 30.03,22.1 v30.41,22.1 | X4.4 X4.1 27.22,14.48 v28.25,14.48 | R124.1 30.33,18.72 v30.03,18.41 | v32.57,14.48 32.05,14.48 31.41,15.11 | R8.1 54.52,18.47 v54.53,18.48 | T1.3 53.72,12.95 53.47,13.21 53.47,14.24 v53.52,14.29 | R1.1 56.36,25.12 v56.34,25.11 | v78.44,48.6 78.48,48.64 U8.5 | v78.44,55.84 78.48,55.88 U9.5 | C35.1 80.34,46.02 v80.34,44.66 | v80.47,51.9 80.43,51.94 C36.1 | R12.2 58.5,57.24 v56.98,57.24 | R139.1 14.91,40.09 v12.91,40.09 | R144.1 v13.03,46.19 | R141.1 14.91,52.79 v13.16,52.79 | R146.1 v13.16,58.89 | R15.2 27.47,53.34 v27,53.81 | R4.2 55.07,30.36 v55.07,29.17 | v67.31,20.32 65.62,20.32 R5.1
  Bottom 0.406: C7.1 v38.84,40.09 | v34.71,33.62 33.88,32.8 C6.1 | C9.1 v33.95,35.19 | C8.1 38.87,37.78 v37.72,36.63 | C1.+ 40.01,33 v40.01,32.18 | C11.1 37.3,28.93 v38.48,30.12 | C22.1 36.21,71.65 35.48,70.93 v35.48,69.66 | v41.45,32.81 42.37,33.74 C2.1 | R123.2 42.22,6.11 v42.22,7.68 42.29,7.76 C23.+ | R122.2 45.14,6.11 v45.14,7.68 | C32.1 20.41,14.73 v19.11,14.73 | v28.25,14.48 26.96,14.48 C34.1 | C31.1 24.98,19.14 v26.09,18.03 | C30.+ 18.03,26.16 v17.96,26.16 | C33.1 21.39,24.57 v21.39,25.52 | C4.1 58.75,29.68 v58.75,28.41 | C21.1 17.68,71.65 17.07,71.04 v17.07,69.66 | L1.P$1 42,30.03 v41.36,30.03
  other vias: 70.16,5.08 71.68,5.08 73.2,5.08 71.68,6.73 70.16,6.73 73.2,6.73
  pour Route15 (isolate 0.178, rank 6): 108.89,-12.06 108.89,114.61 -9.86,114.61 -9.86,-12.06
  pour Top: 82.6,3.81 68.76,3.81 68.76,12.89 77.9,12.89 77.9,7.11 82.6,7.11
+5V  (via drill 0.5)
  Top 0.305: U3.2 82.35,23.84 R22.2
  Top 0.406: OK1.10 v27.61,83.18 | OK1.12 v30.15,83.18 | OK1.14 v32.69,83.18 | OK1.16 v35.23,83.18 | OK4.10 v79.68,70.48 | OK4.12 v77.14,70.48 | OK4.14 v74.6,70.48 | OK4.16 v72.06,70.48 | OK2.12 v13.64,83.18 | OK2.14 v16.18,83.18 | OK2.16 v18.72,83.18 | OK3.10 v61.39,70.48 | OK3.12 v58.85,70.48 | OK3.14 v56.31,70.48 | OK3.16 v53.77,70.48 | OK2.10 v11.1,83.18 | v85.01,59.18 v85.02,59.18 R143.1 | v85.14,55.62 v85.14,55.63 R138.1 | v85.14,52.07 R134.1 | v85.27,48.51 R133.1
  other vias: 70.28,23.5 71.81,23.5 73.33,23.5 73.33,25.4 71.81,25.4 70.28,25.4
  pour Top: 68.76,22.48 68.76,31.11 77.65,31.11 77.65,25.02 82.22,25.02 82.22,22.48
  pour Route15 (rank 2): 68.58,22.23 68.58,36.83 74.93,36.83 74.93,43.18 83.82,43.18 83.82,66.67 50.16,66.67 50.16,79.38 8.26,79.38 8.26,84.45 92.08,84.45 92.08,71.75 95.25,68.58 95.25,40.64 79.38,40.64 79.38,22.23
+24V  (via drill 0.5, 1)
  Top 0.305: U4.6 83.85,16.99 v84.89,18.03 | U3.6 83.85,33.38 84.12,33.66 v86.16,33.66
  Top 0.406: 71.73,88.34 T13.2 71.73,86.45 R96.2 v72.5,86.04 | 76.17,88.34 T14.2 76.17,86.45 R97.2 v76.95,86.04 | 80.62,88.34 T15.2 80.62,86.45 R98.2 v81.39,86.04 | 85.06,88.34 T16.2 85.06,86.45 R99.2 v86.09,86.04 | v61.39,86.04 R67.2 60.3,86.13 T5.2 | v56.95,86.04 R66.2 55.85,86.13 T4.2 | v52.5,86.04 R65.2 51.41,86.13 T3.2 | v66.09,86.04 R68.2 64.75,86.13 T6.2 | v45.72,86.04 R90.2 44.42,86.11 T11.2
  Bottom 0.406: D3.C v86.41,15.24
  other vias: 80.95,10.54 80.95,28.57 90.73,20.83 93.21,20.83
  pour Route15: 103.81,102.36 103.81,84.77 8.56,84.77 8.56,102.36
  pour Top (rank 2): 80.31,7.37 80.31,11.81 82.09,11.81 82.09,7.37
  pour Route15 (rank 3): 102.87,101.6 102.87,8.89 80.01,8.89 80.01,40.64 85.09,40.64 85.09,101.6
  pour Top (rank 3): 80.31,25.4 80.31,30.48 82.09,30.48 82.09,25.4
  pour Top (rank 2): 89.28,18.54 89.28,25.53 96.46,25.53 96.46,18.54
ADC1  (via drill 0.35)
  Top 0.178: U2.8 42.8,25.04 v42.8,24.77 | v25.15,34.54 23.88,34.54 21.08,31.75 R135.2
  Bottom 0.178: v42.8,24.77 41.78,23.75 37.21,23.75 27.05,33.91 25.78,33.91 v25.15,34.54
ADC2  (via drill 0.35)
  Top 0.178: U2.9 41.68,26.9 43.18,25.4 v44.07,25.4 | v24.13,33.02 21.59,30.48 14.99,30.48 13.72,29.21 R132.2
  Bottom 0.178: v44.07,25.4 44.07,24.38 42.55,22.86 36.83,22.86 26.67,33.02 v24.13,33.02
AGND
  Route15 0.406: J11.S1 J11.S2
AVDD  (via drill 0.5)
  Top 0.305: U2.10 40.47,28.78 | 40.47,28.78 40.15,29.1 v40,29.1 | U2.12 41.88,28.78 40.47,28.78
  Route15 0.406: v40,29.1 38.84,27.94 38.1,27.94 33.27,32.77 30.23,32.77 26.92,36.07 19.56,36.07 10.16,26.67 J13.1
  Bottom 0.305: L1.P$2 41,26.78 40.25,27.52 40.25,28.85 v40,29.1
  Bottom 0.406: C12.1 41,26.78
BOOT_SELECT_P2_10  (via drill 0.35)
  Top 0.178: U2.53 33.91,44.53 33.91,46.23 37.08,49.4 39.12,49.4 41.91,52.2 45.09,52.2 48.01,55.12 v52.58,55.12 | v56.77,52.83 R13.1 R120.1
  Bottom 0.178: v52.58,55.12 52.58,53.34 53.09,52.83 v56.77,52.83
BOOT_SELECT_P2_12  (via drill 0.35)
  Top 0.178: U2.51 35.18,44.68 35.18,46.23 37.47,48.51 39.5,48.51 42.29,51.31 45.59,51.31 48.26,53.98 v53.72,53.98 | v57.02,54.99 R14.1
  Bottom 0.178: v53.72,53.98 54.74,54.99 v57.02,54.99
EEPROM_SCL
  Top 0.178: U1.6 55.36,32.51 R4.1 50.43,32.14 49.53,31.24 47.91,31.24 U2.24
EEPROM_SDA
  Top 0.178: U1.5 55.08,33.78 R3.1 54.74,33.62 50.13,33.62 48.26,31.75 48.11,31.75 U2.25
ENCODER_A
  Top 0.178: U2.34 46.68,39.88 70.87,39.88 73.66,42.67 73.66,46.81 74.55,47.7 U8.6
ENCODER_B
  Top 0.178: U2.37 47.22,42.55 67.69,42.55 74.73,49.58 U8.4
ENCODER_PUSH  (via drill 0.35)
  Top 0.178: U2.33 46.5,38.99 71.37,38.99 77.22,44.83 v77.22,45.72 | U9.4 79.93,56.77 v77.22,56.77
  Bottom 0.178: v77.22,45.72 v77.22,56.77
ENCODER_Z
  Top 0.178: U2.38 47.41,43.43 66.8,43.43 72.01,48.64 72.01,52.32 74.55,54.86 79.91,54.86 U9.6
ETH_CRS
  Top 0.178: U7.33 27.3,24.26 31.06,24.26 U2.92
ETH_MDC  (via drill 0.35)
  Top 0.178: U2.87 30.44,27.18 v25.27,27.18 | v24.77,17.27 24.28,17.27 U7.25
  Bottom 0.178: v25.27,27.18 28.57,23.88 28.57,19.56 26.29,17.27 v24.77,17.27
ETH_MDIO  (via drill 0.35)
  Top 0.178: U2.86 30.37,27.81 v26.54,27.81 | U7.24 24.47,16.38 v24.47,15.88
  Bottom 0.178: v26.54,27.81 29.59,24.77 29.59,19.3 26.16,15.88 v24.47,15.88
ETH_RX_ER  (via drill 0.35)
  Top 0.178: v22.78,25.91 30.59,25.91 U2.89 | v25.4,23.37 25.4,23.07 U7.34
  Bottom 0.178: v22.78,25.91 25.32,23.37 v25.4,23.37
ETH_RX_N
  Top 0.178: U7.11 16.35,18.26 16.35,13.78 18.47,11.65 32.77,11.65 | J11.R8 48.26,12.57 47.89,12.2 46.47,12.2 45.66,11.39 37.02,11.39 36.76,11.65 32.77,11.65 | R127.2 33.12,11.29 32.77,11.65
ETH_RX_P
  Top 0.178: U7.12 16.67,17.88 16.67,13.91 18.61,11.97 32.77,11.97 | R126.2 33.11,12.32 32.77,11.97 | 32.77,11.97 36.9,11.97 37.15,11.72 45.52,11.72 46.99,13.19 J11.R7
ETH_RXD_0
  Top 0.178: U7.36 25.68,24.77 30.86,24.77 U2.91
ETH_RXD_1
  Top 0.178: U7.37 25.48,25.27 30.66,25.27 U2.90
ETH_TX_N
  Top 0.178: U7.14 17.62,17.41 17.62,14.16 18.86,12.92 29.66,12.92 30.14,13.39 30.14,16.57 30.55,16.98 32.77,16.98 | 32.77,16.98 41.21,16.98 41.75,16.44 41.75,14.93 41.33,14.52 41.02,14.52 40.64,14.9 J11.R2 | R125.2 33.1,16.64 32.77,16.98
ETH_TX_P
  Top 0.178: U7.15 17.94,17.03 17.94,14.29 18.99,13.24 29.4,13.24 29.81,13.66 29.81,16.7 30.41,17.31 32.77,17.31 | 32.77,17.31 41.34,17.31 42.07,16.58 42.07,14.79 41.47,14.19 40.35,14.19 J11.R1 | R124.2 33.09,17.64 32.77,17.31
ETH_TXD_0  (via drill 0.35)
  Top 0.178: U7.4 18.63,24.34 18.63,25.36 v24.26,30.99 | v33.66,24.13 33.66,24.73 U2.95
  Bottom 0.178: v24.26,30.99 27.3,30.99 33.66,24.64 v33.66,24.13
ETH_TXD_1  (via drill 0.35)
  Top 0.178: U2.94 32.77,24.55 v32.77,22.99 | v18.29,22.99 19.28,22.99 U7.5
  Bottom 0.178: v32.77,22.99 31.37,22.99 30.73,23.62 30.73,24.89 26.67,28.96 23.24,28.96 18.29,24 v18.29,22.99
ETH_TXD_EN  (via drill 0.35)
  Top 0.178: U7.3 19.43,24.25 19.43,24.63 24.89,30.1 v26.16,30.1 | v31.88,24 31.88,24.37 U2.93
  Bottom 0.178: v26.16,30.1 26.92,30.1 31.88,25.15 v31.88,24
ETH_X1  (via drill 0.35)
  Top 0.178: U2.88 30.51,26.54 v24,26.54 | U7.28 25.14,18.54 25.4,18.54 26.16,19.3 v26.8,19.3 26.92,19.3 27.81,18.41 27.81,18.06 X4.3
  Bottom 0.178: v24,26.54 27.56,22.99 27.56,19.94 26.8,19.18 v26.8,19.3
GND  (via drill 0.5, 0.6)
  Top 0.305: U4.11 83.36,13.21 U4.7 83.36,21.78 83.49,21.91 | U3.11 83.36,31.62 U3.7 83.36,37.34 83.49,37.47 | U7.29 24.07,20.32 v23.88,20.32 | U7.13 19.3,19.8 v19.3,20.32 | U7.17 20.87,18.54 21.21,18.54 v21.59,18.16
  Top 0.406: C13.2 76.58,26.67 LED6.C | U4.11 82.86,12.38 | C14.2 LED7.C
  other vias: 90,2 90,10 98,10 98,20 98,30 98,40 98,70 98,90 90,98 80,98 70,98 30,98 20,98 10,98 2,80 2,90 2,70 2,40 2,20 2,10 10,2 40,2 50,2 60,2 70,2 80,2 20,2 50,98 30,2 21.59,20.32 21.59,22.48 20.45,19.18 22.73,21.34 22.73,19.18 20.45,21.46 72.39,44.7 40,98 2,60 2,50 98,60 98,50.51 2,30 60,98
  pour Top (rank 6): 106.35,-9.53 106.35,112.08 -7.32,112.08 -7.32,-9.53
  pour Bottom: 110.16,-13.34 110.16,115.89 -11.12,115.89 -11.12,-13.34
  pour Route2: 107.62,-10.79 107.62,113.34 -8.59,113.34 -8.59,-10.79
  pour Top (rank 6): 80.19,7.11 78.09,7.11 78.09,13.97 84.12,13.97 84.12,12.06 80.19,12.06
I2C_SCL  (via drill 0.35)
  Top 0.178: U2.49 40.64,44.45 v40.64,45.34 | v22.86,43.18 21.59,41.91 16.93,41.91 R140.2 R139.2 14.95,41.91 R130.2
  Bottom 0.178: v22.86,43.18 25.27,45.59 40.39,45.59 v40.64,45.34
I2C_SDA  (via drill 0.35)
  Top 0.178: U2.48 42.04,45.14 v42.04,46.48 | R136.2 14.95,44.45 R144.2 R145.2 16.93,44.45 v21.72,44.45
  Bottom 0.178: v21.72,44.45 23.75,46.48 v42.04,46.48
INPUT1.1  (via drill 0.35)
  Top 0.178: LED16.A v4.13,74.8 4.13,75.88 4.55,76.3 R51.1 R47.2 | U6.9 v7.94,69.53
  Bottom 0.178: v4.13,74.8 4.13,71.44 6.03,69.53 v7.94,69.53
INPUT1.1_MCU  (via drill 0.35)
  Top 0.178: v21.97,58.04 22.61,58.04 23.11,57.53 23.11,46.14 U2.66 | v9.21,64.71 U6.10
  Bottom 0.178: v21.97,58.04 15.88,58.04 v9.21,64.71
INPUT1.2  (via drill 0.35)
  Top 0.178: R46.2 R50.1 9.83,75.55 9.14,74.86 6.1,74.86 v6.03,74.8 6.03,70.23 LED15.A | U6.11 v10.48,69.53
  Bottom 0.178: v6.03,74.8 6.03,72.39 6.67,71.75 9.53,71.75 10.48,70.8 v10.48,69.53
INPUT1.2_MCU  (via drill 0.35)
  Top 0.178: v11.75,64.71 U6.12 | v23.24,59.18 24,58.42 24,45.95 U2.65
  Bottom 0.178: v11.75,64.71 17.27,59.18 v23.24,59.18
INPUT1.3
  Top 0.178: U6.5 11.75,74.61 12.06,74.93 13.02,74.93 13.64,75.55 R49.1 R45.2 15.54,75.58 16.13,74.99 18.54,74.99 18.73,74.8 18.73,70.23 LED14.A
INPUT1.3_MCU  (via drill 0.35)
  Top 0.178: U6.4 v13.02,69.53 | v21.97,60.33 24.13,60.33 24.89,59.56 24.89,46.48 U2.63
  Bottom 0.178: v21.97,60.33 17.91,60.33 13.02,65.22 v13.02,69.53
INPUT1.4  (via drill 0.35)
  Top 0.178: R48.1 R44.2 20.41,76.3 20.64,76.07 20.64,74.62 v20.62,74.61 LED13.A | U6.3 14.29,74.48 v14.61,74.8
  Bottom 0.178: v20.62,74.61 20.43,74.8 v14.61,74.8
INPUT1.4_MCU  (via drill 0.35)
  Top 0.178: v15.56,69.53 U6.2 | v23.24,61.72 25.15,61.72 25.78,61.09 25.78,46.3 U2.62
  Bottom 0.178: v15.56,69.53 15.56,63.94 17.78,61.72 v23.24,61.72
INPUT2.1  (via drill 0.35)
  Top 0.178: R35.2 R39.1 22.53,74.62 v22.54,74.61 22.53,74.6 LED12.A | U5.11 v28.89,69.21
  Bottom 0.178: v22.54,74.61 22.54,71.12 24.45,69.21 v28.89,69.21
INPUT2.1_MCU  (via drill 0.35)
  Top 0.178: v28.51,51.53 28.51,44.98 U2.60 | v29.21,64.52 29.84,64.52 30.16,64.83 U5.12
  Bottom 0.178: v29.21,64.52 29.21,52.7 28.51,52.01 v28.51,51.53
INPUT2.2  (via drill 0.35)
  Top 0.178: LED11.A 24.43,74.6 v24.45,74.61 24.77,74.93 25.72,74.93 26.34,75.55 R38.1 R34.2 | U5.9 v26.35,69.85
  Bottom 0.178: v26.35,69.85 24.45,71.75 v24.45,74.61
INPUT2.2_MCU  (via drill 0.35)
  Top 0.178: v27.62,64.47 U5.10 | v27.11,51.59 27.11,45.67 U2.61
  Bottom 0.178: v27.11,51.59 27.11,52.13 28.19,53.21 28.19,63.89 v27.62,64.47
INPUT2.3  (via drill 0.35)
  Top 0.178: R33.2 R37.1 30.16,76.29 v30.16,74.86 U5.5 | LED10.A 37.15,70.23 v37.15,74.93
  Bottom 0.178: v37.15,74.93 30.23,74.93 v30.16,74.86
INPUT2.3_MCU  (via drill 0.35)
  Top 0.178: v31.43,69.85 U5.4 | v29.91,51.55 29.91,44.29 U2.59
  Bottom 0.178: v29.91,51.55 29.91,52.13 30.23,52.45 30.23,63.25 31.43,64.45 v31.43,69.85
INPUT2.4
  Top 0.178: R36.1 R32.2 38.31,76.3 39.04,75.58 LED9.A | R36.1 33.96,75.89 | U5.3 32.7,74.61 33.02,74.93 33.66,74.93 33.96,75.23 R36.1
INPUT2.4_MCU  (via drill 0.35)
  Top 0.178: v33.97,69.85 U5.2 | U2.58 31.18,43.73 31.18,51.49 v31.3,51.62
  Bottom 0.178: v33.97,69.85 33.97,65.28 31.3,62.61 v31.3,51.62
ISP_RXDO  (via drill 0.35)
  Top 0.178: TC1.4 J8.4 14.48,20.19 15.11,19.56 v15.11,17.78 | v35.18,20.7 35.18,23.43 U2.99
  Bottom 0.178: v15.11,17.78 14.48,17.78 13.97,17.27 13.97,16 19.05,10.92 19.05,8.26 19.94,7.37 29.34,7.37 30.35,8.38 30.35,15.88 30.86,16.38 33.02,16.38 33.91,17.27 33.91,19.43 v35.18,20.7
ISP_TXDO  (via drill 0.35)
  Top 0.178: v15.24,16.38 15.11,16.26 5.71,16.26 4.95,17.02 4.95,19.81 5.33,20.19 J8.3 TC1.3 | v34.04,22.1 34.04,22.99 U2.98
  Bottom 0.178: v34.04,22.1 32.77,20.83 32.77,17.78 32.26,17.27 30.48,17.27 29.46,16.26 29.46,8.76 28.96,8.26 20.57,8.26 19.94,8.89 19.94,11.3 15.24,16 v15.24,16.38
JTAG_TCK  (via drill 0.35)
  Top 0.178: TC2.4 J9.4 15.08,11.97 v15.62,11.43 | v44.83,20.57 44.83,20.88 U2.5
  Bottom 0.178: v44.83,20.57 44.83,19.81 44.32,19.3 42.93,19.3 41.66,20.57 38.1,20.57 35.81,18.29 35.81,14.35 35.18,13.72 33.78,13.72 32.26,12.19 32.26,6.35 31.5,5.59 17.91,5.59 17.27,6.22 17.27,10.16 16,11.43 v15.62,11.43
JTAG_TDI  (via drill 0.35)
  Top 0.178: TC2.8 J9.8 13.94,9.43 v14.86,8.51 | v41.78,18.8 41.78,21.81 U2.2
  Bottom 0.178: v41.78,18.8 41.27,18.29 38.35,18.29 37.59,17.53 37.59,12.45 37.08,11.94 34.54,11.94 34.04,11.43 34.04,5.46 32.26,3.68 15.75,3.68 14.86,4.57 v14.86,8.51
JTAG_TDO  (via drill 0.35)
  Top 0.178: TC2.6 J9.6 14.32,10.7 v14.61,10.41 | v40.39,19.43 40.39,22.5 U2.1
  Bottom 0.178: v40.39,19.43 40.26,19.3 38.1,19.3 36.7,17.91 36.7,13.59 35.94,12.83 34.16,12.83 33.15,11.81 33.15,5.84 31.88,4.57 17.14,4.57 16.26,5.46 16.26,9.14 14.99,10.41 v14.61,10.41
JTAG_TMS  (via drill 0.35)
  Top 0.178: TC2.2 J9.2 14.82,13.24 v14.86,13.21 | U2.3 43.31,20.99 v43.31,20.57
  Bottom 0.178: v43.31,20.57 43.31,20.95 42.72,21.55 37.67,21.55 34.92,18.8 34.92,16.13 34.29,15.49 31.88,15.49 31.24,14.86 31.24,8 29.72,6.48 19.43,6.48 18.16,7.75 18.16,10.54 15.49,13.21 v14.86,13.21
L1_1  (via drill 0.35)
  Top 0.178: J11.L2 47.6,4.47 46.99,5.08 39.88,5.08 38.73,3.94 26.29,3.94 25.27,4.95 v25.27,10.54 | U7.22 24.96,14.48 v25.27,14.48
  Bottom 0.178: v25.27,14.48 v25.27,10.54
L1_2  (via drill 0.35)
  Top 0.178: J11.L4 37.49,2.39 36.83,3.05 25.65,3.05 23.88,4.83 v23.88,10.54 | U7.21 23.88,14.85 v23.88,14.48
  Bottom 0.178: v23.88,14.48 v23.88,10.54
MII_MODE
  Top 0.178: U7.32 26.22,22.48 27.18,22.48 R129.2
MOTOR_VFQ
  Top 0.178: T11.3 43.48,91.12 44.45,92.08 J7.1
  Bottom 0.406: D8.C 44.45,90.92 | 44.45,90.92 R89.2 | 44.45,90.92 J7.1
N$1
  Top 0.178: J1.3 58.67,7.16 58.34,7.49 58.34,10.85 58.85,11.35 59.87,11.35 60.63,12.12 R10.1 58.85,13.76 R11.2
N$2
  Top 0.178: 62.51,13.65 arc-90 R9.1 62.41,11.35 61.72,10.67 59.94,10.67 59.38,10.11 J1.2
N$3
  Top 0.178: R17.1 LED3.C
N$4
  pour Top (rank 4): 86.67,27.3 86.67,30.48 83.49,30.48 83.49,27.3
N$5
  Top 0.178: SW1.3 SW1.4 54.91,59.05 59.94,59.05 60.29,58.71 R12.1 R14.2 R13.2
N$6
  pour Top (rank 2): 86.67,27.3 86.67,24.89 83.24,24.89 83.24,30.23 83.36,30.23 83.36,27.3
N$7
  pour Top (rank 4): 86.67,8.89 86.67,12.06 83.36,12.06 83.36,9.02
N$8
  pour Top (rank 2): 86.67,6.6 86.67,8.89 83.36,8.89 83.36,12.06 83.11,12.06 83.11,6.6
N$9
  Top 0.305: U3.3 82.86,24.13 82.86,23.71
  Top 0.406: R22.1 83.07,24.13 82.86,24.13
  pour Top (rank 3): 86.67,24.77 86.67,22.48 81.58,22.48 81.58,24.77 82.6,24.77 82.6,30.23 82.98,30.23 82.98,24.77
N$10
  Top 0.305: U3.8 82.86,38.73
  pour Top (rank 2): 82.73,32 82.73,38.35 79.3,38.35 79.3,40.64 82.98,40.64 82.98,32
N$11
  pour Top (rank 5): 68.76,31.75 68.76,34.69 74.71,40.64 79.05,40.64 79.05,34.29 82.09,34.29 82.09,31.75
N$12
  pour Top: 82.22,32 82.22,34.54 79.05,34.54 79.05,37.97 82.73,37.97 82.73,32
N$13
  Top 0.305: U4.3 82.86,6.22 82.98,6.1 83.24,6.1 | 83.49,5.08 R24.1
  pour Top (rank 3): 86.67,3.81 86.67,6.48 82.86,6.48 82.86,11.81 82.6,11.81 82.47,6.48 82.47,3.81
N$14
  Top 0.305: U4.8 82.86,20.95
  pour Top (rank 2): 79.05,19.94 82.73,19.94 82.73,13.72 83.11,13.72 83.11,21.97 79.05,21.97
N$15
  pour Top (rank 5): 82.09,13.4 82.09,16 78.54,16.13 78.54,21.97 68.76,21.97 68.76,13.4
N$16
  pour Top: 79.05,16.26 82.22,16.26 82.22,13.59 82.6,13.59 82.6,19.68 79.05,19.68
N$17
  Top 0.178: R100.2 72.06,82.17 T17.1
N$18
  Top 0.178: T13.1 69.85,86.27 R96.1 69.79,85.88 T17.3
N$19
  Top 0.178: R101.2 76.82,81.85 T18.1
N$20
  Top 0.178: T18.3 74.23,85.88 R97.1 74.3,86.27 T14.1
N$21
  Top 0.178: R102.2 81.27,81.85 T19.1
N$22
  Top 0.178: T15.1 78.74,86.27 R98.1 78.68,85.88 T19.3
N$23
  Top 0.178: R103.2 85.39,82.17 T20.1
N$24
  Top 0.178: T20.3 83.12,85.88 R99.1 83.19,86.27 T16.1
N$25
  Top 0.178: R91.1 44.5,80.22 T12.1
N$26
  Top 0.178: T11.1 42.66,88.01 R90.1 42.49,85.87 T12.3
N$27
  Top 0.178: U1.7 59.44,31.24 59.94,30.73 R2.1 58.05,26.83 R1.2
N$28
  Top 0.15: 63.73,18.71 LED1.A
  Top 0.178: R5.2 63.73,18.71
N$29
  Top 0.178: R16.1 LED2.C
N$30
  Top 0.178: T1.2 56.38,14.72 57.06,15.4 R11.1 58.8,16.13 58.17,16.76 R8.2
N$31
  Top 0.178: LED17.A 46.04,74.36 46.99,75.31 48.77,75.31 49.54,76.08 R77.1 R69.1 51.49,78.42 R81.1
N$33
  Top 0.178: OK3.15 55.04,73.48 53.75,74.78 R81.2
N$34  (via drill 0.35)
  Top 0.178: LED18.A v47.95,72.52 | v53.98,77.15 53.98,78.45 R78.1 R70.1 55.89,76.51 R82.1
  Bottom 0.178: v47.95,72.52 47.95,76.27 48.83,77.15 v53.98,77.15
N$35
  Top 0.178: OK3.13 57.58,74.24 57.05,74.78 R82.2
N$36  (via drill 0.35)
  Top 0.178: LED19.A v49.85,72.52 | v58.42,76.96 58.42,78.07 58.43,78.08 R79.1 R71.1 60.34,76.51 R83.1
  Bottom 0.178: v49.85,72.52 49.85,75 50.67,75.82 57.28,75.82 v58.42,76.96
N$37  (via drill 0.35)
  Top 0.178: LED20.A v51.76,72.52 | v61.98,77.4 62.88,78.31 R80.1 R72.1 64.82,78.42 R84.1
  Bottom 0.178: v51.76,72.52 51.76,73.85 52.7,74.8 60.71,74.8 61.98,76.07 v61.98,77.4
N$38
  Top 0.178: OK3.11 60.12,74.52 R83.2
N$39
  Top 0.178: R84.2 63.22,74.78 62.66,74.22 OK3.9
N$40
  Top 0.178: R85.1 54.85,64.28 53.77,65.35 OK3.1
N$41
  Top 0.178: OK1.1 R28.2
N$42
  Top 0.178: R86.1 56.69,64.72 56.31,65.1 OK3.3
N$43
  Top 0.178: R88.1 60.38,64.19 61.39,65.2 OK3.7
N$44
  Top 0.406: R21.1 LED5.A
N$45
  Top 0.406: LED4.C R20.1
N$46
  Top 0.178: R87.1 58.53,64.76 58.85,65.08 OK3.5
N$47
  Top 0.178: OK1.3 R29.2
N$48
  Top 0.178: OK1.5 R30.2
N$49
  Top 0.178: OK1.7 R31.2
N$50
  Top 0.406: 76.48,7.28 LED7.A 76.38,6.48 77.08,5.78 R27.1
N$51
  Top 0.406: R26.1 76.95,24 76.38,24.57 LED6.A
N$52
  Top 0.178: R31.1 29.21,92.94 J3.2
N$53
  Top 0.178: R30.1 31.75,92.94 J3.3
N$54
  Top 0.178: R29.1 34.29,92.94 J3.4
N$55
  Top 0.178: R28.1 36.83,92.94 J3.5
N$56
  Top 0.178: R52.1 LED8.C
N$57
  Top 0.178: LED9.C R53.1
N$58
  Top 0.178: LED10.C R54.1
N$59
  Top 0.178: LED11.C R55.1
N$61
  Top 0.178: R35.1 24.43,79.06 25.07,79.69 25.7,79.69 26.34,80.33 OK1.9
N$62
  Top 0.178: OK1.11 28.88,79.69 28.25,79.06 R34.1
N$63
  Top 0.178: OK1.13 31.42,79.69 32.05,79.06 R33.1
N$64
  Top 0.178: OK1.15 33.96,79.69 34.59,79.06 35.23,79.06 35.87,78.42 R32.1
N$65
  Top 0.178: LED12.C R56.1
N$66
  Top 0.178: R73.1 LED17.C
N$67
  Top 0.178: LED18.C R74.1
N$68
  Top 0.178: LED19.C R75.1
N$69
  Top 0.178: R76.1 LED20.C
N$70
  Bottom 0.406: J1.SHL 66.24,4.86 SJ1.2 55.02,4.86 J1.SHL1
N$71
  Top 0.178: T7.3 49.47,85.89 R65.1 49.62,88.03 T3.1
N$72
  Top 0.178: T8.3 53.91,85.89 R66.1 54.06,88.03 T4.1
N$75  (via drill 0.35)
  Top 0.178: R112.1 R108.1 R100.1 v72.06,76.52 | LED21.A v82.86,72.07
  Bottom 0.178: v82.86,72.07 73.33,72.07 72.06,73.34 v72.06,76.52
N$76
  Top 0.178: R112.2 72.91,74.39 73.33,73.97 OK4.15
N$77
  Top 0.178: T9.3 58.36,85.89 R67.1 58.51,88.03 T5.1
N$78
  Top 0.178: T10.3 62.8,85.89 R68.1 62.95,88.03 T6.1
N$79  (via drill 0.35)
  Top 0.178: R113.1 R109.1 R101.1 v76.82,76.52 | LED22.A 85.39,72.7 v84.76,73.34
  Bottom 0.178: v76.82,76.52 76.82,73.97 77.46,73.34 v84.76,73.34
N$80
  Top 0.178: R113.2 75.45,74.39 75.87,73.97 OK4.13
N$81
  Top 0.178: R40.2 OK2.1
N$82
  Top 0.178: R40.1 20.32,92.94 J4.5
N$83  (via drill 0.35)
  Top 0.178: R114.1 R110.1 R102.1 v81.27,76.52 | LED23.A 87.94,75.88 v87.3,76.52
  Bottom 0.178: v87.3,76.52 v81.27,76.52
N$84
  Top 0.178: R69.2 51.47,80.19 T7.1
N$85
  Top 0.178: R70.2 55.92,80.19 T8.1
N$86  (via drill 0.35)
  Top 0.178: R115.1 R111.1 R103.1 85.39,74.61 v86.03,73.97 | LED24.A 90.47,73.34 v89.84,73.97
  Bottom 0.178: v89.84,73.97 v86.03,73.97
N$87
  Top 0.178: R114.2 78.83,74.39 78.41,73.97 OK4.11
N$88
  Top 0.178: R115.2 81.37,74.39 80.95,73.97 OK4.9
N$89
  Top 0.178: R116.1 73.01,64.28 72.06,65.23 OK4.1
N$90
  Top 0.178: LED16.C R60.1
N$91
  Top 0.178: R117.1 74.85,64.72 74.6,64.97 OK4.3
N$92
  Top 0.178: R119.1 78.66,64.06 79.68,65.08 OK4.7
N$93
  Top 0.178: R118.1 76.69,64.76 77.14,65.2 OK4.5
N$94
  Top 0.178: R104.1 LED21.C
N$95
  Top 0.178: R105.1 LED22.C
N$96
  Top 0.178: R106.1 LED23.C
N$97
  Top 0.178: R107.1 LED24.C
N$98
  Top 0.178: R71.2 60.36,80.19 T9.1
N$99
  Top 0.178: R72.2 64.81,80.19 T10.1
N$100
  Top 0.178: OK2.15 17.45,80.33 18.09,79.69 18.72,79.69 19.36,79.06 R44.1
N$101
  Top 0.178: OK2.3 R41.2
N$102
  Top 0.178: R41.1 17.78,92.94 J4.4
N$103
  Top 0.178: OK2.13 14.91,79.69 15.54,79.06 R45.1
N$104
  Top 0.178: R42.2 OK2.5
N$105
  Top 0.178: R42.1 15.24,92.94 J4.3
N$106
  Top 0.178: OK2.11 12.37,79.69 11.73,79.06 R46.1
N$107
  Top 0.178: R57.1 LED13.C
N$108
  Top 0.178: R58.1 LED14.C
N$109
  Top 0.178: R59.1 LED15.C
N$110
  Top 0.178: R47.1 7.94,79.37 8.26,79.69 9.53,79.69 9.83,80 OK2.9
N$111
  Top 0.178: OK2.7 11.11,87.39 R43.2
N$112
  Top 0.178: R43.1 12.7,92.92 J4.2
N$113
  Bottom 0.406: R122.1 45.63,3.81 49.81,3.81 J11.L1
N$114
  Top 0.406: J1.1 63.78,9.17 64.52,9.91 R7.2
N$115
  Bottom 0.406: R123.1 42.16,3.94 41.71,3.48 J11.L3
N$116
  Top 0.178: U7.20 21.34,16.41 21.34,14.99 20.95,14.61 R128.1
N$117
  Top 0.178: J12.5 93.85,48.51 R133.2 R150.1
N$118
  Top 0.178: J12.4 R134.2 R148.1
N$119
  Top 0.178: J12.3 94.11,53.85 R151.1 R138.2
N$120
  Top 0.178: U9.3 84.51,56.82 85.09,57.4 R149.2
N$121
  Top 0.178: U8.3 84.38,49.58 85.09,50.29 R148.2
N$122
  Top 0.178: U8.1 84.38,47.7 85.34,46.74 R150.2
N$123
  Top 0.178: U9.1 84,54.94 85.09,53.85 R151.2
N$124
  Top 0.178: R143.2 R149.1 94.61,57.4 J12.2
N$125
  Top 0.178: R132.1 J13.2
N$126
  Top 0.178: R135.1 J13.3
N$127
  Top 0.178: R130.1 J14.2
N$128
  Top 0.178: J14.3 R136.1
N$129
  Top 0.178: J15.2 R131.1
N$130
  Top 0.178: J15.3 R137.1
ONBOARD_LED1
  Top 0.178: U2.57 32.13,43.48 32.13,47.24 35.05,50.16 35.05,52.83 36.46,54.24 LED3.A
ONBOARD_LED2
  Top 0.178: U2.56 33.02,43.3 33.02,46.61 35.94,49.53 35.94,52.32 36.7,53.09 44.7,53.09 45.21,53.59 LED2.A
OUTPUT1.1
  Top 0.178: T3.3 50.47,92.06 50.87,92.46 53.59,92.46 54.61,93.47 J5.2
  Bottom 0.406: D4.C 49.35,90.89 R61.2 51.82,92.08 52.2,92.46 54.1,92.46 54.61,92.96 J5.2
OUTPUT1.1_MCU  (via drill 0.35)
  Top 0.178: R85.2 v54.85,60.72 | v61.21,49.02 42.42,49.02 39.88,46.48 39.88,44.39 U2.50
  Bottom 0.178: v61.21,49.02 63.5,51.31 63.5,56.39 62.1,57.78 57.78,57.78 v54.85,60.72
OUTPUT1.2
  Top 0.178: T4.3 54.91,91.42 55.56,92.08 56.39,92.08 57.15,92.84 J5.3
  Bottom 0.178: D5.C 54.38,90.89
  Bottom 0.406: J5.3 56.87,94.65 56.87,90.92 R62.2 54.38,90.89
OUTPUT1.2_MCU  (via drill 0.35)
  Top 0.178: U2.45 46.9,47.88 v58.93,47.88 | v56.64,60.71 56.64,61.84 R86.2
  Bottom 0.178: v58.93,47.88 61.85,47.88 64.77,50.8 64.77,57.15 63.25,58.67 58.67,58.67 v56.64,60.71
OUTPUT1.3
  Top 0.178: T5.3 59.36,91.42 59.69,91.75 J5.4
  Bottom 0.178: D6.C 59.46,90.89
  Bottom 0.406: J5.4 59.69,93.09 60.2,92.58 61.34,92.58 61.95,91.98 61.95,90.92 R63.2 59.46,90.89
OUTPUT1.3_MCU  (via drill 0.35)
  Top 0.178: U2.44 46.47,46.74 63.25,46.74 v64.64,48.13 | v58.55,60.71 58.53,60.72 R87.2
  Bottom 0.178: v64.64,48.13 66.04,49.53 66.04,58.04 64.52,59.56 59.69,59.56 v58.55,60.71
OUTPUT1.4
  Top 0.178: T6.3 63.8,91.9 63.37,92.33 62.74,92.33 62.23,92.84 J5.5
  Bottom 0.178: D7.C 64.54,90.89
  Bottom 0.406: 64.52,90.89 D7.C 64.52,92.08 63.88,92.71 62.87,92.71 62.23,93.34 J5.5 | 64.54,90.89 R64.2
OUTPUT1.4_MCU  (via drill 0.35)
  Top 0.178: U2.43 46.03,45.59 64.64,45.59 v66.93,47.88 | v60.33,60.71 60.33,61.84 R88.2
  Bottom 0.178: v66.93,47.88 67.18,48.13 67.18,59.05 65.53,60.71 v60.33,60.71
OUTPUT2.1
  Top 0.406: T13.3 70.79,91.11 72.39,92.71 J6.2
  Bottom 0.406: 69.6,90.89 D9.C 72.11,90.92 R92.2 72.14,94.68 J6.2
OUTPUT2.1_MCU  (via drill 0.35)
  Top 0.178: U2.39 47.71,44.45 66.04,44.45 v67.31,45.72 | v69.85,59.94 72.39,59.94 73.03,60.58 73.03,61.75 R116.2
  Bottom 0.178: v69.85,59.94 68.58,58.67 68.58,46.99 v67.31,45.72
OUTPUT2.2
  Top 0.406: T14.3 75.23,94.62 J6.3
  Bottom 0.406: 74.68,90.89 D10.C | D10.C 77.19,90.92 R93.2 | J6.3 74.68,94.68 D10.C
OUTPUT2.2_MCU  (via drill 0.35)
  Top 0.178: U2.36 47.04,41.66 68.45,41.66 v69.09,42.29 | v70.61,58.67 73.79,58.67 74.85,59.74 R117.2
  Bottom 0.178: v69.09,42.29 69.85,43.05 69.85,57.91 v70.61,58.67
OUTPUT2.3
  Top 0.406: J6.4 77.47,92.2 77.98,91.69 78.99,91.69 79.68,91.01 T15.3
  Bottom 0.406: J6.4 77.47,94.11 79.76,91.82 D11.C 79.78,90.89 R94.2
OUTPUT2.3_MCU  (via drill 0.35)
  Top 0.178: U2.35 46.86,40.77 69.6,40.77 v71.12,42.29 | v72.77,57.53 75.31,57.53 76.69,58.92 R118.2
  Bottom 0.178: v71.12,42.29 71.12,55.88 v72.77,57.53
OUTPUT2.4
  Top 0.406: T16.3 84.12,91.52 83.69,91.95 81.28,91.95 80.01,93.22 J6.5
  Bottom 0.406: R95.2 84.84,90.89 D12.C 84.84,92.33 84.45,92.71 81.15,92.71 80.01,93.85 J6.5
OUTPUT2.4_MCU  (via drill 0.35)
  Top 0.178: U2.27 47.69,35.94 52.83,35.94 v53.34,35.43 | v78.66,58.85 R119.2
  Bottom 0.178: v78.66,58.85 76.2,58.85 73.66,56.31 73.66,40.64 69.6,36.58 54.48,36.58 v53.34,35.43
OUTPUT3.2_MCU  (via drill 0.35)
  Top 0.178: R91.2 45.54,78.47 v46.35,77.66 44.12,75.42 LED8.A | U2.40 43.45,40.89 43.45,41.42 v46.48,44.45
  Bottom 0.178: v46.35,77.66 46.48,77.53 v46.48,44.45
PFBOUT  (via drill 0.5)
  Top 0.305: U7.16 18.92,17.3 v18.92,16.76 | U7.19 20.32,16.57 v20.32,15.75 | U7.30 25.54,19.83 v26.54,20.83
  Route15 0.406: v18.92,16.76 21.34,16.76 | v26.54,20.83 22.48,16.76 21.34,16.76 | 21.34,16.76 v20.32,15.75
  Bottom 0.406: C27.1 22.35,15.11 21.72,15.75 v20.32,15.75 | C29.1 26.54,22.28 v26.54,20.83 | C28.1 17.31,16.76 v18.92,16.76 18.92,19.05 16.64,21.33 C26.+
RTCX1
  Top 0.178: X1.1 48.91,22.91 C5.1 | U2.16 45.72,27.77 45.72,26.1 X1.1 | 47.3,24.71 X1.1
RTCX2
  Top 0.178: C10.1 50.66,24.69 X1.2 48.65,26.28 44.85,30.08 U2.18
UART_RX  (via drill 0.35)
  Top 0.178: U2.47 43.31,45.7 v43.31,46.1 | v21.46,47.62 19.65,49.44 19.65,54.27 19.34,54.57 R142.2 R141.2 14.95,54.61 R131.2
  Bottom 0.178: v43.31,46.1 43.31,47.24 42.8,47.75 41.4,47.75 41.02,47.37 21.72,47.37 v21.46,47.62
UART_TX  (via drill 0.35)
  Top 0.178: U2.46 44.45,46.14 v44.45,47.12 | v21.59,49.15 20.57,50.16 20.57,56.64 20.03,57.19 R147.2 R146.2 14.95,57.15 R137.2
  Bottom 0.178: v44.45,47.12 44.45,47.88 43.69,48.64 41.02,48.64 40.64,48.26 22.48,48.26 v21.59,49.15
USB_CONNECT  (via drill 0.35)
  Top 0.178: T1.1 57.48,12.01 v57.66,12.19 | U2.64 32.95,37.72 v33.24,37.72 | v48.64,34.42 49.02,34.8 v51.56,34.8
  Bottom 0.178: v57.66,12.19 56.39,12.19 55.88,12.7 55.88,23.62 55.37,24.13 52.83,24.13 51.69,25.27 51.69,34.67 v51.56,34.8 | v48.64,34.42 41.53,41.53 36.2,41.53 33.24,38.57 v33.24,37.72
USB_D_N
  Top 0.178: R9.2 62.41,16.98 62.06,17.32 62.06,25.64 64.93,28.51 64.93,34.74 62.42,37.25 46.88,37.25 U2.30
USB_D_P
  Top 0.178: R10.2 60.63,16.22 61.74,17.32 61.74,25.77 64.61,28.64 64.61,34.6 62.29,36.92 47.26,36.92 U2.29
USB_LED
  Top 0.178: U2.32 46.31,38.1 64.77,38.1 65.41,37.47 66.55,36.32 66.55,27.18 63.63,24.26 LED1.C
USB_V_BUS  (via drill 0.35, 0.5)
  Top 0.305: U2.21 44.4,32.63 v44.32,32.63
  Top 0.406: v66.55,17.27 R6.2 R7.1 v64.52,17.27
  Route15 0.406: v64.52,17.27 59.68,17.27 v44.32,32.63
VBAT+  (via drill 0.5)
  Top 0.305: U2.19 44.33,31.29 v42.97,31.29
  Route15 0.406: v92.46,87.63 v92.46,71.88 | v42.97,31.29 42.97,35.35 49.53,41.91 49.53,60.96 53.34,64.77 v68.58,64.77
  Bottom 0.406: v68.58,64.77 85.34,64.77 v92.46,71.88 94.76,71.88 X3.+1 | v92.46,87.63 94.63,87.63 X3.+2
VIN
  Top 0.406: 89.33,35.43 89.32,35.45
  pour Top: 89.28,25.91 96.32,25.78 96.32,38.12 89.28,38.12
XTAL1
  Top 0.178: U2.22 49.33,28.4 X2.3

## Text on the board
tPlace: INPUTS | INPUTS | VFQ / OUT | OUTPUTS | OUTPUTS | +5V OUT | I1.1 | I1.2 | I1.3 | I1.4 | I2.1 | I2.2 | I2.3 | I2.4 | O3.1 | O1.1 | O1.2 | O1.3 | O1.4 | 02.1 | 02.2 | 02.3 | 02.4 | TX | PUSH | RX | ISP_RST | P2_12 | Z | LED1 | LED2 | P2_10 | +3V3 | B | ISP_BOOT | UART | A | RST | BOOT | ENCODER | SDA | ABK ECS / Rev B1 | SCL | +3V3 | I2C | ADC1 | +24V / 1.1A max | ADC2 | VADC +3V3 | +5V | ADC | FUSE | WP | NO WP | ISCP | +3V3 | nBOOT | TX | RX | GND | nRST | 24V | JTAG | +3V3 | TMS | GND | TCK | GND | TDO | KEY | TDI | +3V3 | GND | nRESET
bPlace: CR1220 3V